# EasyEDA Pro project Project.epro, board PCB_AIO v4.5 Std AMP 2024-02-05
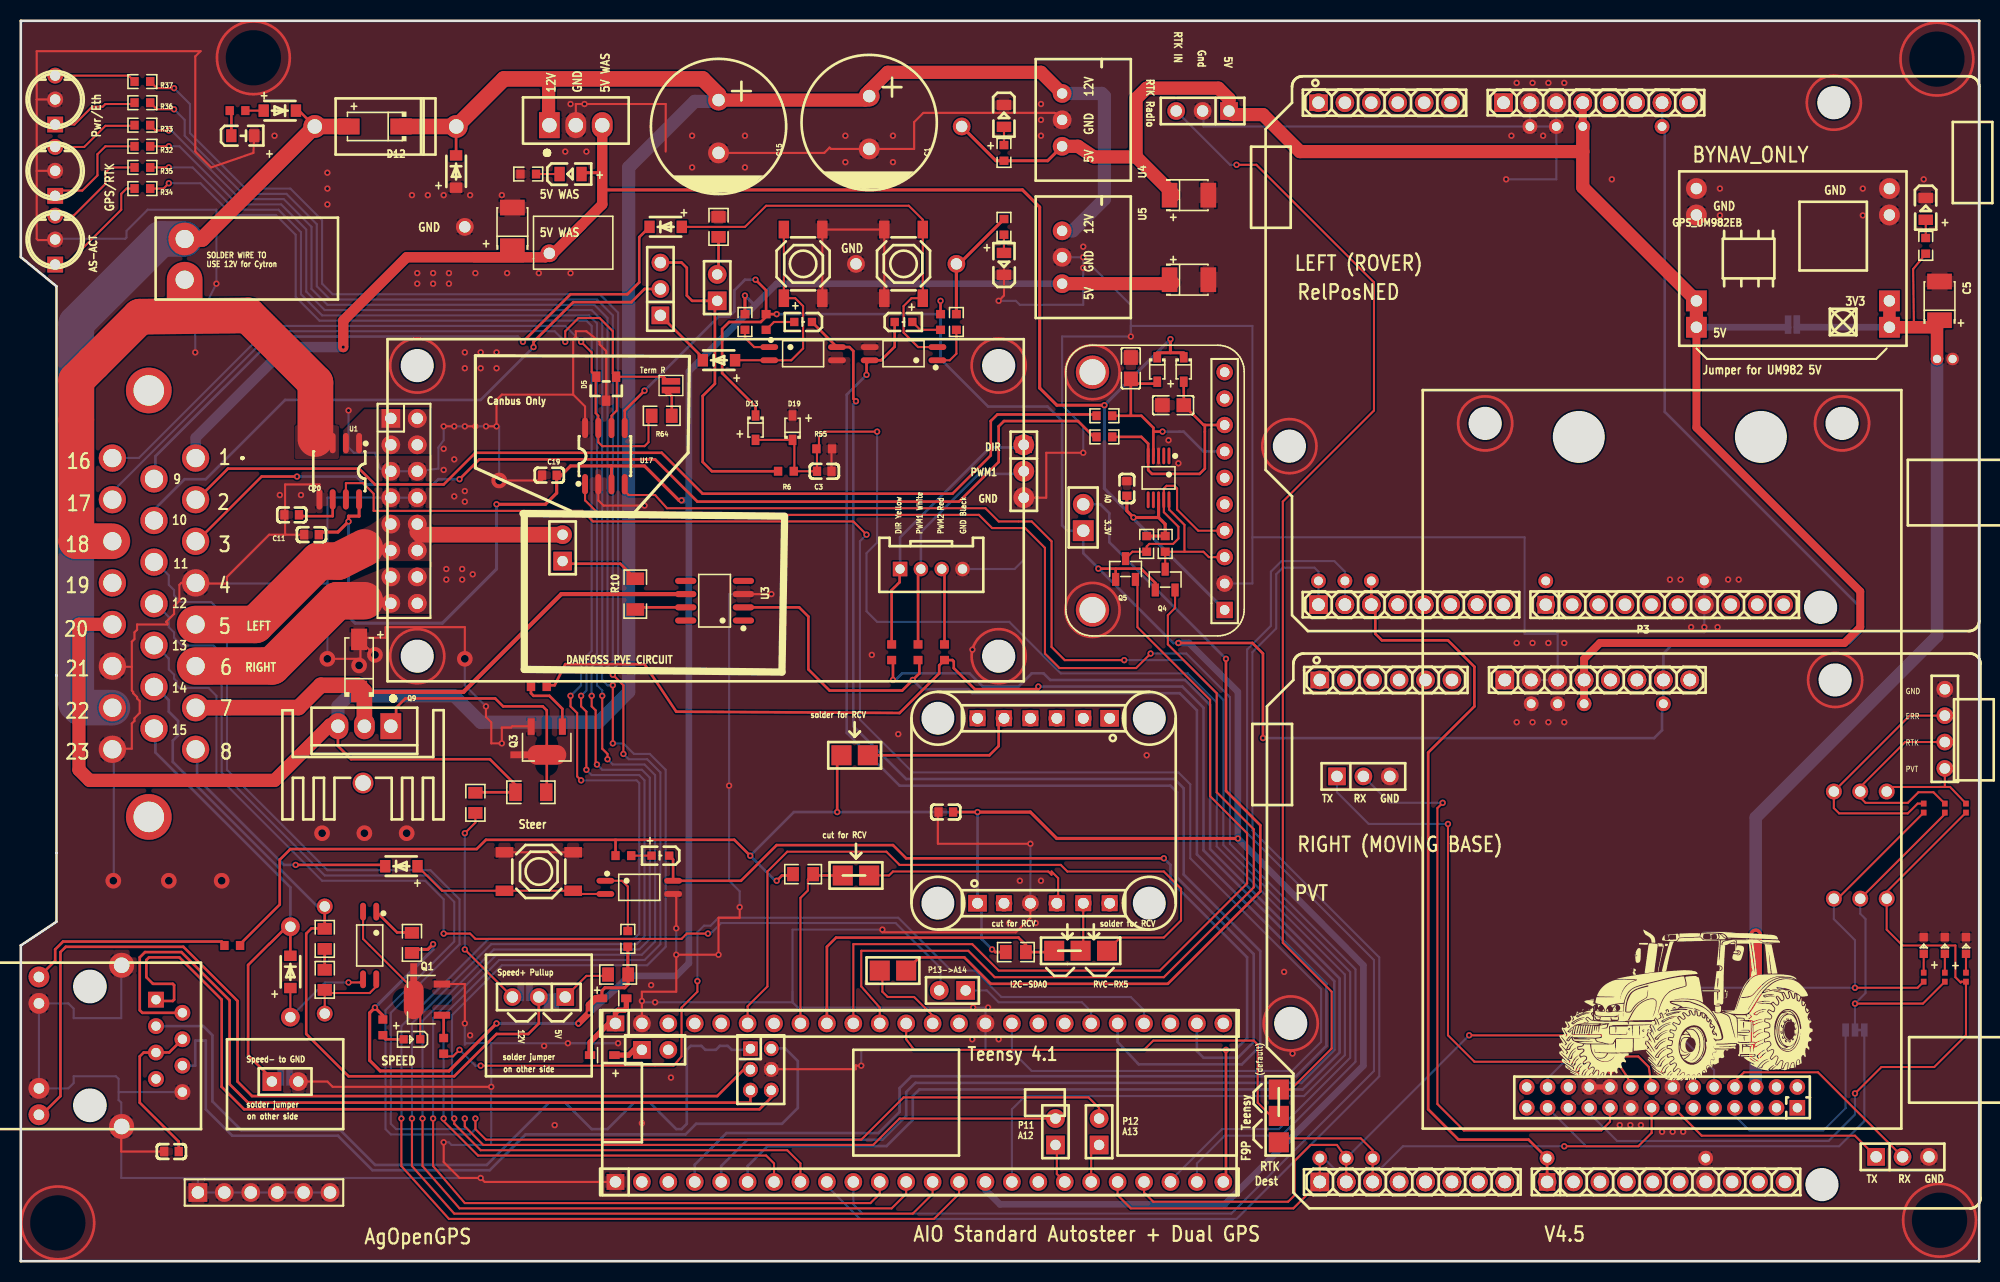
[diagram p0: board, top side]
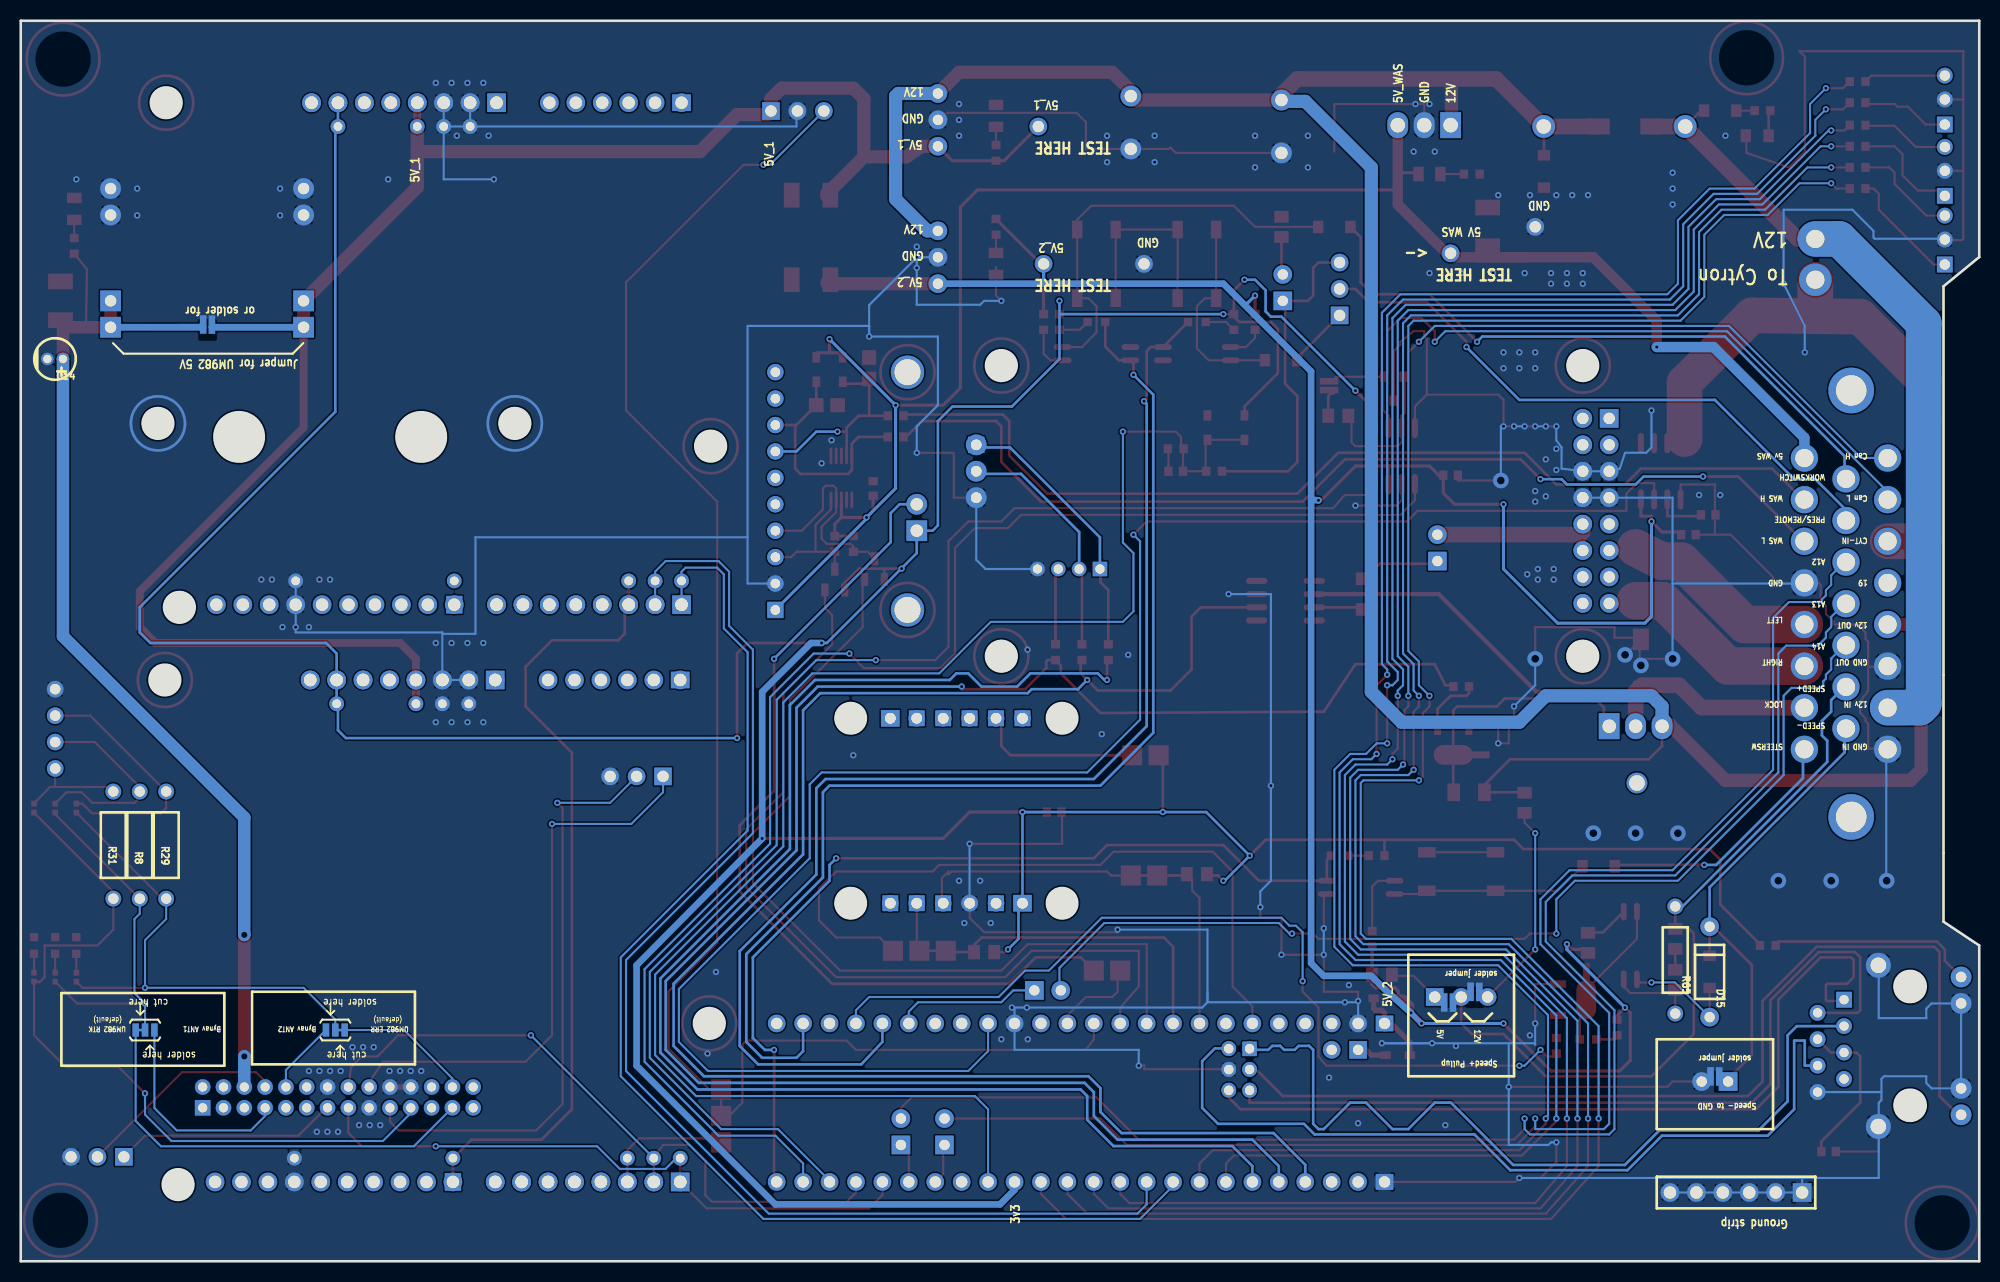
[diagram p1: board, bottom side, seen from below]

Outline 188.21 x 119.25 mm; copper layers: Top Layer, Bottom Layer. Coordinates in mm from the lower left corner of the outline.
Outline path: 0,119.25 188.21,119.25 188.21,0 0,0 0,30.35 3.43,32.64 3.43,93.73 0,96.54 0,119.25
Stack: Top Layer 0.035mm / Dielectric1 1.51mm FR4 er 4.5 / Bottom Layer 0.035mm

## Design rules (mm)
spacing Default (default): track to track 0.2, other pairs 0 to 0.2
spacing 1amp: track to track 0.2, other pairs 0 to 0.2
spacing 3v3: track to track 0.2, other pairs 0 to 0.2
spacing +5V: track to track 0.2, other pairs 0 to 0.2
spacing +15V: track to track 0.2, other pairs 0 to 0.2
spacing heavy: track to track 0.2, other pairs 0 to 0.2
track width Default (default): min 0.2, default 0.2, max 25.4
track width 1amp: min 0.254, default 0.254, max 25.4
track width 3v3: min 0.3, default 0.3, max 25.4
track width +5V: min 0.3, default 0.3, max 25.4
track width +15V: min 1.75, default 1.75, max 25.4
track width heavy: min 1.5, default 1.5, max 25.4
differential pair differentialPair (default): width min 0.127, default 0.254, max 2.54; gap min 0.152, default 0.152
via Default (default): diameter min 0.61, default 0.61, max 100.025; hole min 0.305, default 0.305, max 59.995
via 1amp: diameter min 0.61, default 0.61, max 100.025; hole min 0.305, default 0.305, max 59.995
via 3v3: diameter min 0.61, default 0.61, max 100.025; hole min 0.305, default 0.305, max 59.995
via +5V: diameter min 0.61, default 0.61, max 100.025; hole min 0.305, default 0.305, max 59.995
via +15V: diameter min 0.61, default 0.61, max 100.025; hole min 0.305, default 0.305, max 59.995
via heavy: diameter min 1.499, default 1.499, max 100.025; hole min 0.889, default 0.889, max 59.995
net CYTRON_AUX uses 1amp
net H10_2 uses 1amp
net STEERSW uses 1amp
net PWM2 uses 1amp
net PWM1 uses 1amp
net DIR uses 1amp
net STEERPIN uses 1amp
net WORKPIN uses 1amp
net PRES/REM uses 1amp
net 3.3V uses 1amp
net WAS_L uses 1amp
net WAS_H_2 uses 1amp
net WORKSW uses 1amp
net REMOTESW uses 1amp
net +12V_BOARD uses 1amp
net SPEED+ uses 1amp
net SPEED- uses 1amp
net H8_1 uses 1amp
net H8_2 uses 1amp
net REMOTEPIN uses 1amp
net R7_2 uses 1amp
net R48_2 uses 1amp
net WAS_L_2 uses 1amp
net FREEWHEELMOD uses 1amp
net PRESSURESENSE uses 1amp
net R10_1 uses 1amp
net R10_2 uses 1amp
net R66_2 uses 1amp
net R47_1 uses 1amp
net H18_5 uses 1amp
net H6_1 uses 1amp
net C20_1 uses 1amp
net R64_1 uses 1amp
net WAS_H uses 1amp
net 5V_WAS uses +5V
net 5V1 uses +5V
net 5V2 uses +5V
net +12V_IN uses heavy
net LOCK uses heavy
net RIGHT uses heavy
net LEFT uses heavy
net 12V_CYTRON uses heavy
pour e730 uses gge3228525
pour e1953 uses gge3228492
pour e1955 uses gge3228507

## Placement (name value [footprint] x y rotation side)
AS-ACT  DY-339URUYGW/SN  [LED-TH_3P-BD5.0-P2.54]  3.3 98.17 90 top
B/U_LED1  PVT/DIFF  [LED0603-RD COPY - NO SILK]  186.94 30.35 270 top
B/U_LED2  RTK/ANT1  [LED0603-RD COPY - NO SILK]  184.91 30.35 270 top
B/U_LED3  ERR/ANT2  [LED0603-RD COPY - NO SILK]  182.88 30.35 270 top
C1  1000uF  [CAP-TH_BD13.0-P5.00-D1.2-FD]  81.53 109.47 270 top
C2  100uF  [CASE-B_3528]  112.27 94.36 0 top
C3  100nF  [C0603]  77.22 75.95 180 top
C4  100uF  [CASE-B_3528]  47.24 99.44 90 top
C5  100uF  [CASE-B_3528]  184.4 92.33 90 top
C11  100nF_CAN  [C0603]  27.94 69.85 0 top
C14  22uF  [CAP-TH_BD4.0-P1.50-D0.8-FD]  184.91 86.74 0 bottom
C15  1000uF  [CAP-TH_BD13.0-P5.00-D1.2-FD]  67.06 109.09 270 top
C16  100nF  [C0603]  106.3 74.29 90 top
C17  100nF  [C0603]  88.9 43.18 0 top
C19  100nF  [C0603]  50.8 75.56 0 top
C20  1nF  [C0603]  26.03 71.75 180 top
C23  100uF  [CASE-B_3528]  112.27 102.49 0 top
C26  100nF  [C0603]  14.48 10.54 0 top
C30  10nF  [C0805]  106.68 85.85 270 top
C31  10nF  [C0805]  110.74 82.3 180 top
CN1  CYTRON CABLE  [CONN-TH_SEEED-110990030]  87.5 66.55 180 top
CN2  HEADER_ethernet-2X3P  [HDR-TH_6P-P2.00-V-F-R2-C3-S2.00]  71.12 18.42 270 top
D1  SM4007PL  [SOD-123F_L2.8-W1.8-LS3.7-RD]  36.58 37.97 0 top
D2  1N5819WS  [SOD-323_L1.8-W1.3-LS2.5-RD]  111.76 85.72 270 top
D3  SM4007PL  [SOD-123F_L2.8-W1.8-LS3.7-RD]  25.91 27.81 270 top
D4  SM4007PL  [SOD-123F_L2.8-W1.8-LS3.7-RD]  24.89 110.62 180 top
D5  PESD1CAN,215  [SOT-23_L2.9-W1.3-P1.90-LS2.4-BR]  56.26 83.88 90 top
D6  SS54_C22452  [SMA_L4.4-W2.8-LS5.4-R-RD]  34.04 109.09 180 top
D7  SM4007PL  [SOD-123F_L2.8-W1.8-LS3.7-RD]  41.83 104.76 270 top
D8  SS54_C22452  [SMA_L4.4-W2.8-LS5.4-R-RD]  32.51 57.28 90 top
D9  SM4007PL  [SOD-123F_L2.8-W1.8-LS3.7-RD]  67.09 86.62 0 top
D11  SM4007PL  [SOD-123F_L2.8-W1.8-LS3.7-RD]  61.98 99.44 0 top
D12  1N5401  [DO-201_BD5.3-L9.5-P13.50-D1.4-RD]  35.05 109.09 180 top
D13  1N5819WS  [SOD-323_L1.8-W1.3-LS2.5-RD]  70.61 80.14 270 top
D14  1N5819WS  [SOD-323_L1.8-W1.3-LS2.5-RD COPY - NO SILK]  57.02 25.27 180 top
D15  1N4004  [DO-41_BD2.4-L4.7-P8.70-D0.9-FD]  25.91 27.81 90 bottom
D19  1N5819WS  [SOD-323_L1.8-W1.3-LS2.5-RD]  74.17 80.14 90 top
D22  1N5819WS  [SOD-323_L1.8-W1.3-LS2.5-RD]  109.22 85.72 270 top
D41  1N5819WS  [SOD-323_L1.8-W1.3-LS2.5-RD COPY - NO SILK]  55.88 19.81 0 top
GPS/RTK  DY-339URUYGW/SN  [LED-TH_3P-BD5.0-P2.54]  3.3 104.77 90 top
GPS_UM982EB  UM982eb GPS  [UM982-NO-PADS - MIN]  170.73 14.75 0 top
H2  P11-A12  [HDR-TH_2P-P2.54-V-M-1]  99.44 12.45 90 top
H3  Ground  [HDR-TH_6P-P2.54-V-M-1]  23.37 6.6 0 top
H4  4-20ma  [HDR-TH_2P-P2.54-V-M-1]  66.93 93.6 90 top
H5  P12-A13  [HDR-TH_2P-P2.54-V-M-1]  103.63 12.45 90 top
H6  HEADER_F9P  [HDR-TH_10P-P2.54-V-F]  158.12 7.62 0 top
H7  HEADER_F9P  [HDR-TH_10P-P2.54-V-F]  157.99 63.12 0 top
H8  HEADER_3PIN  [HDR-TH_3P-P2.54-V-F]  96.39 75.95 270 top
H9  HEADER_ADS-MCP6002  [HDR-F-2.54_1X10]  115.7 74.04 90 top
H10  22850102ANG1SYA02  [HDR-TH_2P-P2.54-V-F]  102.11 71.5 90 top
H11  Speed-  [HDR-TH_2P-P2.54-V-M-1]  25.4 17.27 0 top
H12  PZ254V-11-03P_C2937625  [HDR-TH_3P-P2.54-V-M]  113.58 110.58 180 top
H13  HEADER_F9P  [HDR-TH_6P-P2.54-V-F]  131.19 55.88 0 top
H14  HEADER_F9P  [HDR-TH_6P-P2.54-V-F]  131.06 111.38 0 top
H15  P13-A14  [HDR-TH_2P-P2.54-V-M-1]  89.53 26.03 180 top
H16  Remote/Pressure  [HDR-TH_3P-P2.54-V-M]  61.47 93.47 90 top
H17  ByNav/UM982 uart3  [HDR-TH_3P-P2.54-V-M]  180.85 10.03 0 top
H18  HEADER_BNO  [HDR-TH_6P-P2.54-V-F]  98.3 52.2 180 top
H19  HEADER_BNO  [HDR-TH_6P-P2.54-V-F]  98.3 34.42 0 top
H20  2263-214SG0DYNT5 - wide  [HDR-TH_28P-P2.00-V-F-R2-C14-S2.00]  170.73 14.75 180 top
H21  VUSB  [HDR-TH_2P-P2.54-V-F#2]  60.96 20.32 0 top
H22  Danfoss Us  [HDR-TH_2P-P2.54-V-M-1]  52.07 68.58 90 top
H23  Speed+ Pullup  [HDR-TH_3P-P2.54-V-M]  49.78 25.4 180 top
H24_LEDS  Ext LEDs  [HDR-TH_4P-P2.54-V-F-2]  184.91 51.18 90 top
H25  ByNav/UM982 uart2  [HDR-TH_3P-P2.54-V-M]  129.03 46.61 0 top
J2  AMPSEAL 23 - 776087-1  [7760871-EXT]  16.8 77.21 270 top
J3  HEADER_Cytron 2x8  [HDR-TH_16P-P2.54-V-F-R2-C8-S2.54-1]  36.83 72.14 270 top
JP1  A0  [2_SOLDER_JUMPER_LG]  83.82 27.94 0 top
JP2  SPARKFUN-JUMPERS_JUMPER-SMT_2_NC_PASTE_NO-SILK  [SPARKFUN-JUMPERS_SMT-JUMPER_2_NC_PASTE_NO-SILK]  61.98 84.26 90 top
JP3  SLC  [2_SOLDER_JUMPER_LG]  80.26 37.08 0 top
JP4  RVC Mode  [2_SOLDER_JUMPER_LG]  80.14 48.64 180 top
JP6  SPARKFUN-JUMPERS_JUMPER-SMT_2_NC_PASTE_NO-SILK  [SPARKFUN-JUMPERS_SMT-JUMPER_2_NC_PASTE_NO-SILK#2]  25.31 17.76 180 bottom
JP7  SPARKFUN-JUMPERS_JUMPER-SMT_2_NC_PASTE_NO-SILK  [SPARKFUN-JUMPERS_SMT-JUMPER_2_NC_PASTE_NO-SILK#2]  51.08 24.88 0 bottom
JP8  SPARKFUN-JUMPERS_JUMPER-SMT_2_NC_PASTE_NO-SILK  [SPARKFUN-JUMPERS_SMT-JUMPER_2_NC_PASTE_NO-SILK#2]  48.37 25.88 180 bottom
JP9  UM982 5V  [SPARKFUN-JUMPERS_SMT-JUMPER_2_NC_PASTE_NO-SILK#2]  170.18 90.04 180 bottom
LED4  5V2  [LED0805-R-RD]  94.49 95.88 90 top
LED5  5V1  [LED0805-R-RD]  94.49 110.11 270 top
LED7  5V_WAS  [LED0805-R-RD]  52.83 104.52 0 top
LED8  3V3  [LED0805-R-RD]  183.08 101.17 270 top
LED12  SPEED_LED  [LED0603-RD]  37.59 21.34 180 top
LED18  INVERTED 12V!  [LED0805-RD]  21.34 108.2 0 top
LED_REMOTE  Remote  [LED0603-R-RD_WHITE]  75.18 90.3 180 top
LED_STEER  Steer  [LED0603-R-RD_WHITE]  61.47 38.99 180 top
LED_WORK  Work  [LED0603-R-RD_WHITE]  84.84 90.3 0 top
NOREF  -  [Pad_e4290]  90.42 109.09 0 top
NOREF#2  -  [Pad_e4155]  15.75 98.28 0 top
NOREF#3  -  [Pad_e4291]  89.92 95.88 0 top
NOREF#4  -  [Pad_e4289]  50.8 96.9 0 top
NOREF#5  -  [Pad_e4293]  80.26 95.88 270 top
NOREF#6  -  [Pad_e4156]  15.75 94.36 0 top
NOREF#7  -  [Pad_e4292]  42.67 99.44 270 top
OPTO_REMOTE  Remote  [SOP-4_L4.4-W2.8-P1.27-LS7.0-TL]  75.18 87.25 0 top
OPTO_SPEEDPULSE  Speed Pulse  [SOP-4_L4.4-W2.8-P1.27-LS7.0-TL]  33.53 30.35 270 top
OPTO_STEER  Steer  [SOP-4_L4.4-W2.8-P1.27-LS7.0-TL]  59.44 35.94 0 top
OPTO_WORK  Work  [SOP-4_L4.4-W2.8-P1.27-LS7.0-TL]  84.84 87.25 180 top
P2  Single/Dual-Right  [ARDUSIMPLE_F9P#2]  147.19 31.75 180 top
P3  F9P_RelPosNED  [ARDUSIMPLE_F9P]  147.07 87.25 180 top
P4  ADS1115  [ADS1115 BREAKOUT BOARD]  108.08 73.91 90 top
P5  Header_F9P  [HDR-TH_8P-P2.54-V-F-1]  133.73 7.62 0 top
P6  Header_F9P  [HDR-TH_8P-P2.54-V-F-1]  151.51 55.88 0 top
P7  Header_F9P  [HDR-TH_8P-P2.54-V-F-1]  151.38 111.38 0 top
P8  Header_F9P  [HDR-TH_8P-P2.54-V-F-1]  133.6 63.12 0 top
PWR/ETH  DY-339URUYGW/SN  [LED-TH_3P-BD5.0-P2.54]  3.3 111.63 90 top
Q1  D882_C9634  [SOT-89-3_L4.5-W2.5-P1.50-LS4.2-BR]  39.12 25.15 0 top
Q3  D882_C9634  [SOT-89-3_L4.5-W2.5-P1.50-LS4.2-BR]  50.55 50.04 90 top
Q4  2N7002  [SOT-23-3_L2.9-W1.3-P1.90-LS2.4-BR]  109.98 65.53 270 top
Q5  2N7002  [SOT-23-3_L2.9-W1.3-P1.90-LS2.4-BR]  106.17 66.55 270 top
Q9  IRF5305PBF  [TO-220-3_L10.0-W4.5-P2.54-T]  33.02 51.43 270 top
R1  1kΩ  [R0603 COPY - NO SILK]  71.63 90.3 270 top
R2  270Ω  [R0603]  58.34 30.99 270 top
R3  270Ω  [R0603]  69.6 90.3 90 top
R4  1kΩ  [R0603 COPY - NO SILK]  20.32 30.35 180 top
R5  1kΩ  [R0603 COPY - NO SILK]  83.69 58.55 90 top
R6  6.2kΩ  [R0603 COPY - NO SILK]  73.53 75.95 180 top
R7  200Ω  [R0805]  67.06 99.44 270 top
R8  1k  [RES-TH_BD2.4-L6.3-P10.30-D0.6]  176.78 40 270 bottom
R9  5.1kΩ  [R0603]  94.49 106.55 270 top
R10  1kΩ  [R1206]  59.06 64.13 90 top
R11  5.1kΩ  [R0603]  48.77 104.52 0 top
R12  2.2kΩ  [R0805]  75.18 37.21 0 top
R13  2.2kΩ  [R0805]  95.63 29.72 0 top
R14  1kΩ  [R0603 COPY - NO SILK]  88.39 90.3 270 top
R15  1kΩ  [R0603 COPY - NO SILK]  57.91 38.99 0 top
R16  270Ω  [R0603]  89.92 90.3 90 top
R17  5.1kΩ  [R0603]  94.49 99.44 90 top
R18  120Ω  [R0805]  29.21 27.05 270 top
R19  2.2kΩ  [R0805]  43.69 44.07 270 top
R20  3kΩ  [R0603]  183.08 97.62 90 top
R21  1kΩ  [R0603 COPY - NO SILK]  40.64 20.7 90 top
R22  5.1kΩ  [R0603]  108.2 68.96 270 top
R23  1kΩ  [R0603 COPY - NO SILK]  86.23 58.55 90 top
R24  1kΩ  [R0603 COPY - NO SILK]  49.78 55.24 180 top
R25  1kΩ  [R0603 COPY - NO SILK]  88.77 58.55 270 top
R26  1kΩ  [R0402 COPY - NO SILK]  184.91 27.3 90 top
R27  1kΩ  [R0402 COPY - NO SILK]  182.88 27.3 90 top
R28  1kΩ  [R0402 COPY - NO SILK]  182.88 43.56 90 top
R29  1k  [RES-TH_BD2.4-L6.3-P10.30-D0.6]  174.24 40 270 bottom
R30  1kΩ  [R0402 COPY - NO SILK]  186.94 43.56 90 top
R31  1k  [RES-TH_BD2.4-L6.3-P10.30-D0.6]  179.32 40 270 bottom
R32  330Ω  [R0603]  11.68 107.19 0 top
R33  330Ω  [R0603]  11.68 109.22 0 top
R34  330Ω  [R0603]  11.68 103.12 0 top
R35  330Ω  [R0603]  11.68 105.16 0 top
R36  330Ω  [R0603]  11.68 111.38 0 top
R37  330Ω  [R0603]  11.68 113.41 0 top
R38  1kΩ  [R0402 COPY - NO SILK]  184.91 43.56 90 top
R47  10kΩ  [R1206]  49.02 45.08 180 top
R48  200Ω  [R0805]  37.59 30.61 90 top
R53  1.5kΩ  [R0603]  104.14 81.28 180 top
R55  12kΩ  [R0603 COPY - NO SILK]  77.22 78.1 180 top
R56  1.5kΩ  [R0603]  104.14 79.25 180 top
R59  1kΩ  [R0402 COPY - NO SILK]  186.94 27.3 90 top
R62  2.2kΩ  [R0805]  57.4 27.56 180 top
R63  5.1kΩ  [R0603]  109.98 68.96 270 top
R64  120Ω  [R0805]  61.59 81.28 180 top
R65  330  [RES-TH_BD2.4-L6.3-P10.30-D0.6]  29.21 28.96 90 bottom
R66  200Ω  [R0805]  29.21 30.99 270 top
R104  2kΩ  [R0603 COPY - NO SILK]  34.8 22.48 270 top
R106  1kΩ  [R0603 COPY - NO SILK]  20.83 110.62 0 top
RJ1  HR913550A  [RJ45-TH_HR913550A]  8.64 20.7 90 top
SJ1  SDA/RX5  [3_SOLDER_JUMPER_LG]  103.12 29.84 0 top
SJ2  JUMPER-PAD-3-NO  [3_SOLDER_JUMPER_LG]  120.9 15.24 90 top
SJ_LED2  SJ_LED1  [PAD-JUMPER-3-2OF3_NC_BY_TRACE_YES]  176.28 22.22 0 bottom
SJ_LED3  SJ_LED1  [PAD-JUMPER-3-2OF3_NC_BY_TRACE_YES]  157.99 22.22 180 bottom
SW_REMOTE  Remote  [SW-SMD_4P-L5.1-W5.1-P3.70-LS6.5-TL-2]  75.18 95.88 90 top
SW_STEER  Steer  [SW-SMD_4P-L5.1-W5.1-P3.70-LS6.5-TL-2]  49.78 37.46 180 top
SW_WORK  Work  [SW-SMD_4P-L5.1-W5.1-P3.70-LS6.5-TL-2]  84.84 95.88 270 top
U1  ACS712ELCTR-05B-T  [SOIC-8_L5.0-W4.0-P1.27-LS6.0-BL]  30.61 75.95 180 top
U2  Cytron MD13S  [CYTRON MD13S]  66.04 72.14 270 top
U3  TC4427AEOA713  [SOIC-8_L4.9-W3.9-P1.27-LS6.0-BL]  66.67 63.5 90 top
U4  GNSS power  [PWRM-TH_K7805M-1000R3]  100.08 109.73 270 top
U5  Teensy/IMU Power  [PWRM-TH_K7805M-1000R3]  100.08 96.52 270 top
U6  MC7805CTG  [TO-220-3_L10.0-W4.5-P2.54-T#2]  53.34 109.22 90 top
U10  HEADER_TEENSY  [HDR-TH_24P-P2.54-V-F]  86.36 22.86 0 top
U11  HEADER_TEENSY  [HDR-TH_24P-P2.54-V-F]  86.36 7.62 0 top
U12  Teensy4.1 ETH only  [TEENSY4.1 ETH ONLY]  56.01 6.35 90 top
U13  HEAT_SINK  [SINK-TH_L15.0-W10.5-H21.0]  32.89 45.97 180 top
U15  Ardfruit BNO085  [ADAFRUIT-BNO085]  103.38 54.74 0 top
U16  -  [MP1584EN]  161.04 89.79 90 top
U17  MCP2562-E/SN  [SOIC-8_L5.0-W4.0-P1.27-LS6.0-BL]  56.13 77.41 0 top
U20  ADS1115IDGSR  [MSOP-10_L3.0-W3.0-P0.50-LS5.0-BL]  109.35 75.31 180 top

## Footprints (pads in the part's own frame, mm; a bottom-side part is the same pattern mirrored in y, then rotated)
2_SOLDER_JUMPER_LG
  rect 1.931x1.931 smd: 1(1.27,0) 2(-1.27,0)
3_SOLDER_JUMPER_LG
  rect 1.931x1.931 smd: 1(1.27,0) 2(-1.27,0) 3(-3.81,0)
7760871-EXT
  round 2.625 hole 1.755x1.75: 1(0,0) 2(4,0) 3(8,0) 4(12,0) 5(16,0) 6(20,0) 7(24,0) 8(28,0) 9(2,-4) 10(6,-4) 11(10,-4) 12(14,-4) 13(18,-4) 14(22,-4) 15(26,-4) 16(0,-8) 17(4,-8) 18(8,-8) 19(12,-8) 20(16,-8) 21(20,-8) 22(24,-8) 23(28,-8)
  round 4.395 hole 2.93x2.93: MH1(-6.5,-4.5) MH2(34.5,-4.5)
ADAFRUIT-BNO085
  rect 1.524x1.524 hole 1.016: 1(-11.43,-20.32) 2(-8.89,-20.32) 4(-3.81,-20.32) 5(-1.27,-20.32) 6(1.27,-20.32) 7(1.27,-2.54) 8(-1.27,-2.54) 9(-3.81,-2.54) 10(-6.35,-2.54) 11(-8.89,-2.54) 12(-11.43,-2.54)
  round 1.524 hole 1.016: 3(-6.35,-20.32)
ADS1115 BREAKOUT BOARD
  round 1.524 hole 0.914: 1(-11.303,-7.62) 2(-8.763,-7.62) 3(-6.223,-7.62) 4(-3.683,-7.62) 5(-1.143,-7.62) 6(1.397,-7.62) 7(3.937,-7.62) 8(6.477,-7.62) 9(9.017,-7.62) 10(11.557,-7.62)
  round 3.2 hole 2.499: P$1(-11.303,5.08) P$2(11.557,5.08)
ARDUSIMPLE_F9P
  round 1.8 hole 1.2: 1(0.508,24.13) 2(-2.032,24.13) 3(-4.572,24.13) 4(-7.112,24.13) 5(-9.652,24.13) 6(-12.192,24.13) 7(-14.732,24.13) 8(-17.272,24.13) 9(-19.812,24.13) 10(-22.352,24.13) 11(22.352,24.13) 12(19.811,24.13) 13(17.271,24.13) 14(14.732,24.13) 15(12.191,24.13) 16(9.652,24.13) 17(7.112,24.13) 18(4.572,24.13) 19(9.652,-24.13) 20(12.192,-24.13) 21(14.732,-24.13) 22(17.272,-24.13) 23(19.812,-24.13) 24(22.352,-24.13) 25(-13.208,-24.13) 26(-10.668,-24.13) 27(-8.128,-24.13) 28(-5.588,-24.13) 29(-3.048,-24.13) 30(-0.508,-24.13) 31(2.032,-24.13) 32(4.572,-24.13)
  round 1.423 hole 0.849: 1(0.508,21.845) 7(-14.732,21.844) 11(22.352,21.844) 12(19.811,21.844) 13(17.271,21.844) 26(-10.668,-21.844) 29(-3.048,-21.844) 30(-0.508,-21.844) 31(2.032,-21.844)
ARDUSIMPLE_F9P#2
  round 1.8 hole 1.2x1.205: 1(0.508,24.13) 2(-2.032,24.13) 3(-4.572,24.13) 4(-7.112,24.13) 5(-9.652,24.13) 6(-12.192,24.13) 7(-14.732,24.13) 8(-17.272,24.13) 9(-19.812,24.13) 10(-22.352,24.13) 11(22.352,24.13) 12(19.811,24.13) 13(17.271,24.13) 14(14.732,24.13) 15(12.191,24.13) 16(9.652,24.13) 17(7.112,24.13) 18(4.572,24.13) 19(9.652,-24.13) 20(12.192,-24.13) 21(14.732,-24.13) 22(17.272,-24.13) 23(19.812,-24.13) 24(22.352,-24.13) 25(-13.208,-24.13) 26(-10.668,-24.13) 27(-8.128,-24.13) 28(-5.588,-24.13) 29(-3.048,-24.13) 30(-0.508,-24.13) 31(2.032,-24.13) 32(4.572,-24.13)
  round 1.423 hole 0.849x0.854: 1(0.508,21.845) 7(-14.732,21.844) 11(22.352,21.844) 12(19.811,21.844) 13(17.271,21.844) 26(-10.668,-21.844) 29(-3.048,-21.844) 30(-0.508,-21.844) 31(2.032,-21.844)
C0603
  rect 0.8x0.9 smd: 1(-0.7,0) 2(0.7,0)
C0805
  rect 1.41x1.35 smd: 1(-1.03,0) 2(1.03,0)
CAP-TH_BD4.0-P1.50-D0.8-FD
  round 1.2 hole 0.8: 1(-0.75,0) 2(0.75,0)
CAP-TH_BD13.0-P5.00-D1.2-FD
  round 2 hole 1.2: 1(-2.54,0) 2(2.54,0)
CASE-B_3528
  rect 1.506x2.376 smd: 1(-1.861,0) 2(1.861,0)
CONN-TH_SEEED-110990030
  rect 1.4x1.4 hole 0.9: 1(3,0)
  round 1.4 hole 0.9: 2(1,0) 3(-1,0) 4(-3,0)
CYTRON MD13S
  round 2 hole 1: 1(-6.35,30.353) 2(-3.81,30.353) 3(-1.27,30.353)
  round 1.75 hole 1: 4(-8.89,-27.94) 4(-6.35,-27.94) 5(-3.81,-27.94) 5(-1.27,-27.94) 6(1.27,-27.94) 6(3.81,-27.94) 7(6.35,-27.94) 7(8.89,-27.94)
DO-41_BD2.4-L4.7-P8.70-D0.9-FD
  round 1.8 hole 1: 1(-4.35,0) 2(4.35,0)
DO-201_BD5.3-L9.5-P13.50-D1.4-RD
  round 2.2 hole 1.4: 1(-6.8,0) 2(6.8,0)
HDR-F-2.54_1X10
  rect 1.575x1.575 hole 0.889: 1(-11.43,0)
  round 1.575 hole 0.889: 2(-8.89,0) 3(-6.35,0) 4(-3.81,0) 5(-1.27,0) 6(1.27,0) 7(3.81,0) 8(6.35,0) 9(8.89,0) 10(11.43,0)
HDR-TH_2P-P2.54-V-F
  rect 2x2 hole 1.2: 1(-1.27,0)
  round 2 hole 1.2: 2(1.27,0)
HDR-TH_2P-P2.54-V-F#2
  rect 1.7x1.7 hole 1: 1(-1.27,0)
  round 1.7 hole 1: 2(1.27,0)
HDR-TH_2P-P2.54-V-M-1
  rect 1.8x1.8 hole 1: 1(-1.27,0)
  round 1.8 hole 1: 2(1.27,0)
HDR-TH_3P-P2.54-V-F
  rect 1.575x1.575 hole 1.02: 1(-2.54,0)
  round 1.575 hole 1.02: 2(0,0) 3(2.54,0)
HDR-TH_3P-P2.54-V-M
  rect 1.7x1.7 hole 1.1: 1(-2.54,0)
  round 1.7 hole 1.1: 2(0,0) 3(2.54,0)
HDR-TH_4P-P2.54-V-F-2
  round 1.6 hole 1.02: 1(-3.81,0) 2(-1.27,0) 3(1.27,0) 4(3.81,0)
HDR-TH_6P-P2.00-V-F-R2-C3-S2.00
  rect 1.4x1.4 hole 0.9: 1(-2,-1)
  round 1.4 hole 0.9: 2(-2,1) 3(0,-1) 4(0,1) 5(2,-1) 6(2,1)
HDR-TH_6P-P2.54-V-F
  rect 1.8x1.6 hole 1.02: 1(-6.35,0)
  round 1.6 hole 1.02: 2(-3.81,0) 3(-1.27,0) 4(1.27,0) 5(3.81,0) 6(6.35,0)
HDR-TH_6P-P2.54-V-M-1
  rect 1.8x1.8 hole 1.2: 1(-6.35,0)
  round 1.8 hole 1.2: 2(-3.81,0) 3(-1.27,0) 4(1.27,0) 5(3.81,0) 6(6.35,0)
HDR-TH_8P-P2.54-V-F-1
  rect 1.8x1.8 hole 1.2: 1(-8.89,0)
  round 1.8 hole 1.2: 2(-6.35,0) 3(-3.81,0) 4(-1.27,0) 5(1.27,0) 6(3.81,0) 7(6.35,0) 8(8.89,0)
HDR-TH_10P-P2.54-V-F
  rect 1.575x1.7 hole 1.1: 1(-11.43,0)
  round 1.7 hole 1.1: 2(-8.89,0) 3(-6.35,0) 4(-3.81,0) 5(-1.27,0) 6(1.27,0) 7(3.81,0) 8(6.35,0) 9(8.89,0) 10(11.43,0)
HDR-TH_16P-P2.54-V-F-R2-C8-S2.54-1
  rect 1.8x1.8 hole 1.1: 1(-8.89,-1.27)
  round 1.8 hole 1.1: 2(-8.89,1.27) 3(-6.35,-1.27) 4(-6.35,1.27) 5(-3.81,-1.27) 6(-3.81,1.27) 7(-1.27,-1.27) 8(-1.27,1.27) 9(1.27,-1.27) 10(1.27,1.27) 11(3.81,-1.27) 12(3.81,1.27) 13(6.35,-1.27) 14(6.35,1.27) 15(8.89,-1.27) 16(8.89,1.27)
HDR-TH_24P-P2.54-V-F
  rect 1.7x1.524 hole 1.1: 1(-29.21,0)
  round 1.7 hole 1.1: 2(-26.67,0) 3(-24.13,0) 4(-21.59,0) 5(-19.05,0) 6(-16.51,0) 7(-13.97,0) 8(-11.43,0) 9(-8.89,0) 10(-6.35,0) 11(-3.81,0) 12(-1.27,0) 13(1.27,0) 14(3.81,0) 15(6.35,0) 16(8.89,0) 17(11.43,0) 18(13.97,0) 19(16.51,0) 20(19.05,0) 21(21.59,0) 22(24.13,0) 23(26.67,0) 24(29.21,0)
HDR-TH_28P-P2.00-V-F-R2-C14-S2.00
  rect 1.5x1.5 hole 0.889: 1(0,0)
  round 1.5 hole 0.889: 2(0,-2) 3(2,0) 4(2,-2) 5(4,0) 6(4,-2) 7(6,0) 8(6,-2) 9(8,0) 10(8,-2) 11(10,0) 12(10,-2) 13(12,0) 14(12,-2) 15(14,0) 16(14,-2) 17(16,0) 18(16,-2) 19(18,0) 20(18,-2) 21(20,0) 22(20,-2) 23(22,0) 24(22,-2) 25(24,0) 26(24,-2) 27(26,0) 28(26,-2)
LED0603-R-RD_WHITE
  rect 0.8x0.8 smd: 1(0.851,0) 2(-0.851,0)
LED0603-RD
  rect 0.8x0.8 smd: 1(-0.799,-0.004) 2(0.799,0.004)
LED0603-RD COPY - NO SILK
  rect 0.8x0.8 smd: 1(-0.799,-0.004) 2(0.799,0.004)
LED0805-R-RD
  rect 1x1.399 smd: 1(1.05,0) 2(-1.05,0)
LED0805-RD
  rect 1x1.25 smd: 1(-1.1,0) 2(1.1,0)
LED-TH_3P-BD5.0-P2.54
  rect 1.524x1.524 hole 1: 1(-2.349,0)
  round 1.524 hole 1: 2(0.059,0) 3(2.349,0)
MP1584EN
  rect 2x2 hole 1.1: 1(0,0) 1(2.54,0) 3(0,-18.55) 3(2.54,-18.55)
  round 2 hole 1.1: 2(10.795,0) 2(13.335,0) 4(10.795,-18.55) 4(13.335,-18.55)
MSOP-10_L3.0-W3.0-P0.50-LS5.0-BL
  oval 0.28x1.62 smd: 1(-1,-2.11) 2(-0.5,-2.11) 3(0,-2.11) 4(0.5,-2.11) 5(1,-2.11) 6(1,2.11) 7(0.5,2.11) 8(0,2.11) 9(-0.5,2.11) 10(-1,2.11)
PAD-JUMPER-3-2OF3_NC_BY_TRACE_YES
  custom 0.635x1.27 smd: 1(-0.9,0) 2(0,0) 3(0.9,0)
Pad_e4155
  round 3.13 hole 1.752: 1(0,0)
Pad_e4156
  round 3.13 hole 1.752: 2(0,0)
Pad_e4289
  round 1.7 hole 1.1: 3(0,0)
Pad_e4290
  round 1.7 hole 1.1: 4(0,0)
Pad_e4291
  round 1.7 hole 1.1: 4(0,0)
Pad_e4292
  round 1.7 hole 1.1: 2(0,0)
Pad_e4293
  round 1.7 hole 1.1: 2(0,0)
PWRM-TH_K7805M-1000R3
  round 1.8 hole 1: 1(-2.54,0) 2(0,0) 3(2.54,0)
R0402 COPY - NO SILK
  rect 0.566x0.54 smd: 1(-0.433,0) 2(0.433,0)
R0603
  rect 0.806x0.864 smd: 1(-0.753,0) 2(0.753,0)
R0603 COPY - NO SILK
  rect 0.806x0.864 smd: 1(-0.753,0) 2(0.753,0)
R0805
  rect 1.133x1.377 smd: 1(-0.966,0) 2(0.966,0)
R1206
  rect 1.208x1.701 smd: 1(-1.479,0) 2(1.479,0)
RES-TH_BD2.4-L6.3-P10.30-D0.6
  round 1.524 hole 1: 1(-5.15,0) 2(5.15,0)
RJ45-TH_HR913550A
  rect 1.524x1.524 hole 0.9: 1(4.44,-4.355)
  round 1.524 hole 0.9: 2(3.18,-6.895) 3(1.9,-4.355) 4(0.64,-6.895) 5(-0.64,-4.355) 6(-1.9,-6.895) 7(-3.18,-4.355) 8(-4.44,-6.895)
  round 2 hole 1.02: 9(6.625,6.895) 10(4.085,6.895) 11(-4.085,6.895) 12(-6.625,6.895)
  round 2.4 hole 1.5: 13(7.75,-1.055) 14(-7.75,-1.055)
SINK-TH_L15.0-W10.5-H21.0
  round 2 hole 1.5: 1(0,0)
SMA_L4.4-W2.8-LS5.4-R-RD
  rect 2.062x1.539 smd: 1(2.503,0) 2(-2.503,0)
SOD-123F_L2.8-W1.8-LS3.7-RD
  rect 1x1.2 smd: 1(-1.55,0) 2(1.55,0)
SOD-323_L1.8-W1.3-LS2.5-RD
  rect 1x0.75 smd: 1(-1.173,0) 2(1.173,0)
SOD-323_L1.8-W1.3-LS2.5-RD COPY - NO SILK
  rect 1x0.75 smd: 1(-1.173,0) 2(1.173,0)
SOIC-8_L4.9-W3.9-P1.27-LS6.0-BL
  oval 0.588x2.045 smd: 1(-1.905,-2.772) 2(-0.635,-2.772) 3(0.635,-2.772) 4(1.905,-2.772) 5(1.905,2.772) 6(0.635,2.772) 7(-0.635,2.772) 8(-1.905,2.772)
SOIC-8_L5.0-W4.0-P1.27-LS6.0-BL
  oval 0.569x1.95 smd: 1(-1.905,-2.705) 2(-0.635,-2.705) 3(0.635,-2.705) 4(1.905,-2.705) 5(1.905,2.705) 6(0.635,2.705) 7(-0.635,2.705) 8(-1.905,2.705)
SOP-4_L4.4-W2.8-P1.27-LS7.0-TL
  oval 1.71x0.56 smd: 1(-3.255,0.635) 2(-3.255,-0.635) 3(3.255,-0.635) 4(3.255,0.635)
SOT-23-3_L2.9-W1.3-P1.90-LS2.4-BR
  rect 1.25x0.7 smd: 1(1,-0.95) 2(1,0.95) 3(-1,0)
SOT-23_L2.9-W1.3-P1.90-LS2.4-BR
  rect 1x0.8 smd: 1(1.15,-0.95) 2(1.15,0.95) 3(-1.15,0)
SOT-89-3_L4.5-W2.5-P1.50-LS4.2-BR
  rect 1.575x0.672 smd: 1(1.357,-1.5) 3(1.357,1.5)
  custom 1.9x5.377 smd: 2(-1.356,-0.001)
SPARKFUN-JUMPERS_SMT-JUMPER_2_NC_PASTE_NO-SILK
  custom 0.635x1.778 smd: 1(-0.508,0.254) 2(0.33,-0.254)
SPARKFUN-JUMPERS_SMT-JUMPER_2_NC_PASTE_NO-SILK#2
  custom 0.635x1.778 smd: 1(-0.508,-0.246) 2(0.331,-0.254)
SW-SMD_4P-L5.1-W5.1-P3.70-LS6.5-TL-2
  rect 1.7x1 smd: 1(-3.3,1.85) 2(3.3,1.85) 3(-3.3,-1.85) 4(3.3,-1.85)
TEENSY4.1 ETH ONLY
  round 1.524 hole 0.95: 1(1.27,-1.143) 2(1.27,-3.683) 3(1.27,-6.223) 4(1.27,-8.763) 5(1.27,-11.303) 6(1.27,-13.843) 7(1.27,-16.383) 8(1.27,-18.923) 9(1.27,-21.463) 10(1.27,-24.003) 11(1.27,-26.543) 12(1.27,-29.083) 13(1.27,-31.623) 14(1.27,-34.163) 15(1.27,-36.703) 16(1.27,-39.243) 17(1.27,-41.783) 18(1.27,-44.323) 19(1.27,-46.863) 20(1.27,-49.403) 21(1.27,-51.943) 22(1.27,-54.483) 23(1.27,-57.023) 24(1.27,-59.563) 25(16.51,-59.563) 26(16.51,-57.023) 27(16.51,-54.483) 28(16.51,-51.943) 29(16.51,-49.403) 30(16.51,-46.863) 31(16.51,-44.323) 32(16.51,-41.783) 33(16.51,-39.243) 34(16.51,-36.703) 35(16.51,-34.163) 36(16.51,-31.623) 37(16.51,-29.083) 38(16.51,-26.543) 39(16.51,-24.003) 40(16.51,-21.463) 41(16.51,-18.923) 42(16.51,-16.383) 43(16.51,-13.843) 44(16.51,-11.303) 45(16.51,-8.763) 46(16.51,-6.223) 47(16.51,-3.683) 48(16.51,-1.143)
  round 1.4 hole 0.85: 60(14.11,-14.113) 61(12.11,-14.113) 62(10.11,-14.113) 63(10.11,-16.113) 64(12.11,-16.113) 65(14.11,-16.113)
TO-220-3_L10.0-W4.5-P2.54-T
  rect 2.5x2 hole 1.3: 1(0,2.54)
  oval 2.5x2 hole 1.3: 2(0,0) 3(0,-2.54)
TO-220-3_L10.0-W4.5-P2.54-T#2
  rect 2.5x2 hole 1.4: 1(0,2.54)
  oval 2.5x2 hole 1.4: 2(0,0) 3(0,-2.54)

## Nets
3.3V: C17.2 D13.1 H10.1 H19.1 JP4.1 P2.26 P3.26 P6.7 P7.7 Q4.1 Q5.1 R1.1 R4.1 R12.1 R13.1 R14.1 R15.1 U11.15 U12.15 U15.1 U17.5
5V1: C23.1 H12.1 JP9.2 NOREF.4 P2.29 P3.29 P6.4 P7.4 R9.2 U4.3 U16.1
5V2: C2.1 C11.2 C19.2 D14.2 NOREF#3.4 R2.2 R3.2 R16.2 R17.2 R48.1 R62.1 R104.1 U1.8 U5.3 U17.3
5V_WAS: C4.1 C16.1 D2.1 D22.1 H9.1 J2.1 LED7.1 NOREF#4.3 P4.1 R22.1 R63.1 U6.3 U20.8
12V_CYTRON: J3.1 J3.2 J3.3 J3.4 U1.1 U1.2 U2.4
+12V_BOARD: C1.1 C15.1 D6.2 D7.1 D12.1 J2.20 Q9.3 R19.1 R47.2 U4.1 U5.1 U6.1
+12V_IN: D4.1 D6.1 D12.2 J2.22 NOREF#2.1
GND: AS-ACT.2 B/U_LED1.1 B/U_LED2.1 B/U_LED3.1 C1.2 C2.2 C3.1 C4.2 C5.2 C11.1 C14.2 C15.2 C16.2 C17.1 C19.1 C20.2 C23.2 C26.1 C30.1 C31.2 CN1.4 CN2.4 D5.3 D7.2 D8.1 D19.2 GPS/RTK.2 H3.1 H3.2 H3.3 H3.4 H3.5 H3.6 H6.7 H7.7 H8.3 H9.2 H11.2 H12.2 H17.3 H19.3 H20.14 H20.17 H20.20 H20.22 H24_LEDS.4 H25.3 J2.4 J2.21 J2.23 J3.5 J3.6 J3.7 J3.8 JP6.1 LED4.2 LED5.2 LED8.2 LED18.2 NOREF#5.2 NOREF#7.2 OPTO_REMOTE.3 OPTO_STEER.3 OPTO_WORK.3 P2.7 P2.30 P2.31 P3.7 P3.30 P3.31 P4.2 P6.2 P6.3 P7.2 P7.3 PWR/ETH.2 Q1.3 Q3.3 R7.1 R11.1 R55.1 RJ1.8 RJ1.10 RJ1.11 RJ1.13 RJ1.14 SW_REMOTE.3 SW_REMOTE.4 SW_STEER.3 SW_STEER.4 SW_WORK.3 SW_WORK.4 U1.5 U2.3 U2.5 U3.3 U4.2 U5.2 U6.2 U10.2 U10.15 U11.1 U12.1 U12.34 U12.47 U12.64 U15.3 U16.2 U16.4 U17.2 U17.8 U20.3
A0: JP1.2 U10.13 U12.36
A7-RX5: SJ1.1 U10.6 U12.43
A10: C3.2 D13.2 D19.1 R6.1 R55.2 U11.16 U12.16
A12: H2.1 U11.18 U12.18
A12B: H2.2 J2.11
A13: H5.1 U11.19 U12.19
A13B: H5.2 J2.12
A14: H15.1 U10.19 U12.30
A14B: H15.2 J2.13
A15: U10.18 U12.31
A16: U10.17 U12.32
A17: U1.7 U10.16 U12.33
AS-ACT_1: AS-ACT.1 R34.1
AS-ACT_3: AS-ACT.3 R35.1
AS_ACT: R34.2 U11.14 U12.14
AS_STB: R35.2 U11.13 U12.13
B/U_LED1_2: B/U_LED1.2 R59.2
BNO-SDA: H19.5 R13.2 SJ1.2 SJ1.3 U10.9 U12.40 U15.5
BY-ANT1: H20.7 SJ_LED2.1
BY-ANT2: H20.10 SJ_LED3.1
BYNAV/UM982: C5.1 C14.1 H20.6 JP9.1 R20.1 U16.3
C20_1: C20.1 U1.6
CANH1: D5.2 J2.16 R64.2 U17.7
CANL1: D5.1 J2.17 JP2.2 U17.6
CANRX1: U11.22 U12.22 U17.4
CANTX1: U11.23 U12.23 U17.1
CYTRON_AUX: J2.18 NOREF#6.2 U1.3 U1.4
D1_2: D1.2 OPTO_STEER.2 SW_STEER.1 SW_STEER.2
D4_2: D4.2 R106.2
D9_2: D9.2 OPTO_REMOTE.2 SW_REMOTE.1 SW_REMOTE.2
D11_2: D11.2 OPTO_WORK.2 SW_WORK.1 SW_WORK.2
D15_1: D3.2 D15.1 OPTO_SPEEDPULSE.3
DIR: R5.1 U11.6 U12.6
ERR_STAT: H20.26 SJ_LED3.3
ETHERNET: R36.2 U11.8 U12.8
FREEWHEELMOD: CN1.3 R25.1
GPS/RTK_1: GPS/RTK.1 R32.1
GPS/RTK_3: GPS/RTK.3 R33.1
GPSFIX: R33.2 U11.11 U12.11
H6_1: H6.1 P2.1 P3.13 P8.3
H8_1: CN1.1 H8.1 R5.2 U2.1
H8_2: CN1.2 H8.2 R23.2 U2.2
H10_2: H10.2 JP1.1
H18_5: H18.5 JP4.2 U15.11
H24_LEDS_1: H24_LEDS.1 R30.2 R31.1
H24_LEDS_2: H24_LEDS.2 R8.1 R38.2
H24_LEDS_3: H24_LEDS.3 R28.2 R29.1
L2: R8.2 R26.1 R38.1 SJ_LED2.2
L3: R27.1 R28.1 R29.2 SJ_LED3.2
LED12_1: LED12.1 OPTO_SPEEDPULSE.2 Q1.2
LED12_2: LED12.2 R104.2
LED18_1: LED18.1 R106.1
LED_REMOTE_1: LED_REMOTE.1 R1.2
LED_STEER_1: LED_STEER.1 R15.2
LED_WORK_1: LED_WORK.1 R14.2
LEFT: H22.2 J2.5 J3.9 J3.10 J3.11 J3.12 U2.6
LOCK: D8.2 J2.7 Q9.2 U3.6
POWERON: R37.2 U11.7 U12.7
PRES/REM: H16.2 J2.10
PRESSURESENSE: H4.1 H16.3 R6.2
PVT_STAT/DIFF: H20.21 R30.1 R31.2 R59.1
PWM1: R23.1 U3.2 U11.4 U12.4
PWM2: R24.1 R25.2 U11.5 U12.5
PWR/ETH_1: PWR/ETH.1 R36.1
PWR/ETH_3: PWR/ETH.3 R37.1
Q1_1: Q1.1 R21.2
Q3_1: Q3.1 R24.2
R2_1: OPTO_STEER.1 R2.1
R3_1: OPTO_REMOTE.1 R3.1
R7_2: H4.2 R7.2
R9_1: LED5.1 R9.1
R10_1: R10.1 U3.7
R10_2: H22.1 R10.2
R11_2: LED7.2 R11.2
R16_1: OPTO_WORK.1 R16.1
R17_1: LED4.1 R17.1
R18_2: OPTO_SPEEDPULSE.4 R18.2 R65.1
R20_2: LED8.1 R20.2
R26_2: B/U_LED2.2 R26.2
R27_2: B/U_LED3.2 R27.2
R47_1: Q3.2 Q9.1 R47.1
R48_2: OPTO_SPEEDPULSE.1 R48.2
R62_2: H23.1 JP7.2 R62.2
R64_1: JP2.1 R64.1
R66_2: R18.1 R66.2
R+: CN2.1 RJ1.3 U12.60
R-: CN2.2 RJ1.6 U12.65
REMOTEPIN: D9.1 H16.1
REMOTESW: LED_REMOTE.2 OPTO_REMOTE.4 U10.20 U12.29
RIGHT: J2.6 J3.13 J3.14 J3.15 J3.16 U2.7
RJ1_5: C26.2 RJ1.4 RJ1.5
RJ1_9: R4.2 RJ1.9
RJ1_12: CN2.3 RJ1.12 U12.61
RTK_STAT: H20.25 SJ_LED2.3
RTKFIX: R32.2 U11.12 U12.12
RX1: H20.15 P2.11 P5.1 U11.20 U12.20
RX2: P3.11 P8.1 U11.9 U12.9
SCL0: H19.4 JP3.1 JP3.2 R12.2 U10.8 U12.41 U15.4
SCL_HV: H9.3 P4.3 Q4.3 R63.2 U20.10
SCL_LV: Q4.2 U10.11 U12.38
SDA_HV: H9.4 P4.4 Q5.3 R22.2 U20.9
SDA_LV: Q5.2 U10.10 U12.39
SIG: H12.3 SJ2.1 SJ2.2 U10.12 U12.37
SJ3_3: H23.3 JP8.2 R19.2
SPEED+: H23.2 J2.14 JP7.1 JP8.1 R65.2 R66.1
SPEED-: D3.1 D15.2 H11.1 J2.15 JP6.2
SPEEDPULSE: R21.1 U10.21 U12.28
STEERPIN: D1.1 J2.8
STEERSW: LED_STEER.2 OPTO_STEER.4 U11.24 U12.24
T+: CN2.6 RJ1.1 U12.63
T-: CN2.5 RJ1.2 U12.62
T_VUSB: D41.2 H21.1
TX1: H20.16 P2.12 P5.2 U11.21 U12.21
TX2: P3.12 P8.2 U11.10 U12.10
TX2_F9P: P2.13 P5.3 SJ2.3
U9_2: U10.22 U12.27
U9_4: U10.24 U12.25
U12_2: U11.2 U12.2
U12_3: U11.3 U12.3
U12_17: U11.17 U12.17
U12_35: U10.14 U12.35
U12_42: U10.7 U12.42
U12_44: U10.5 U12.44
U12_45: U10.4 U12.45
U12_46: U10.3 U12.46
U12_48: D14.1 D41.1 U10.1 U12.48
U-RX2: H20.19 H25.2
U-RX3: H17.2 H20.8
U-TX2: H20.18 H25.1
U-TX3: H17.1 H20.13
WAS_H: J2.2 R53.2
WAS_H_2: C30.2 D22.2 H9.7 P4.7 R53.1 U20.4
WAS_L: J2.3 R56.2
WAS_L_2: C31.1 D2.2 H9.8 P4.8 R56.1 U20.5
WORKPIN: D11.1 J2.9
WORKSW: LED_WORK.2 OPTO_WORK.4 U10.23 U12.26

Pads without a net: H6 2 3 4 5 6 8 9 10; H7 1 2 3 4 5 6 8 9 10; H9 5 6 9 10; H13 1 2 3 4 5 6; H14 1 2 3 4 5 6; H18 1 2 3 4 6; H19 2 6; H20 1 2 3 4 5 9 11 12 23 24 27 28; H21 2; J2 19 MH1 MH2; P2 2 3 4 5 6 8 9 10 14 15 16 17 18 19 20 21 22 23 24 25 27 28 32; P3 1 2 3 4 5 6 8 9 10 14 15 16 17 18 19 20 21 22 23 24 25 27 28 32; P4 5 6 9 10 P$1 P$2; P5 4 5 6 7 8; P6 1 5 6 8; P7 1 5 6 8; P8 4 5 6 7 8; RJ1 7; U3 1 4 5 8; U13 1; U15 2 6 7 8 9 10 12; U20 1 2 6 7

## Via types
v1: diameter 0.61, hole 0.305, Top Layer to Bottom Layer, 243 vias
v2: diameter 1.5, hole 0.75, Top Layer to Bottom Layer, 11 vias
v3: diameter 1.2, hole 0.6, Top Layer to Bottom Layer, 2 vias

## Routing (per net, layer and track width the routed paths; a pad name or vN(x,y) marks a point on that pad's centre or on a via; arc(x,y) is an arc through that point)
3.3V: length 480.9
  Top Layer w0.254: Q5.1 105.22,66.58 ; v1(72.64,36.58) 73.15,37.08 74.09,37.08 R12.1 ; R13.1 93.65,29.72 93.4,29.97 v1(93.34,29.97) ; R15.1 57.16,40.51 ; v1(78.46,43.18) 78.46,48.23 JP4.1 ; 109.03,64.53 109.03,65.21 107.66,66.58 v1(103.56,66.58) ; v1(70.1,38.98) 68.57,40.51 44.7,40.51 43.81,39.62 25.91,39.62 24.88,38.6 24.88,34.29 21.07,30.48 ; v1(119.38,50.29) 119.38,58.42 118.36,59.44 v1(111.25,59.44) ; v1(59.94,83.69) 58.04,81.79 U17.5 ; R1.1 71.63,90.8 71.12,90.3 68.07,90.3 67.4,89.63 67.4,85.38 70.61,82.17 70.61,81.31 ; R1.1 v1(72.64,91.05) ; R1.1 71.63,93.34 v1(70.61,94.36) ; v1(91.95,43.18) C17.2 ; v1(88.39,92.33) R14.1
  Top Layer w0.305: v1(91.95,43.18) 97.03,43.18 99.57,40.64 v1(116.97,40.64)
  Bottom Layer w0.254: P7.7 P3.26 157.73,108.97 157.99,108.71 157.99,81.66 176.78,62.86 176.78,60.45 175.77,59.44 158.88,59.44 157.86,58.42 P6.7 157.86,53.59 157.73,53.47 157.73,51.05 156.97,50.29 v1(119.38,50.29) ; v1(59.94,83.69) 67.06,90.8 68.07,90.8 68.58,91.31 68.58,93.34 69.6,94.36 v1(70.61,94.36) ; v1(93.34,29.97) 92.33,30.99 92.33,34.04 H19.1 v1(91.95,43.18) v1(78.46,43.18) 74.3,43.18 v1(70.1,38.98) 72.51,36.58 v1(72.64,36.58) ; v1(72.64,91.05) R14.1 ; v1(88.39,92.33) 88.39,86.74 92.96,82.17 98.68,82.17 100.08,80.77 100.08,70.74 100.58,70.23 H10.1 102.11,68.07 110.74,59.44 v1(111.25,59.44)
  Bottom Layer w0.635: v1(111.25,59.44) 112.27,59.44 116.97,54.74 v1(116.97,40.64) 129.03,28.45 129.03,18.8 115.7,5.46 94.11,5.46 92.71,6.86 U11.15
5V1: length 178.9
  Top Layer w0.3: NOREF.4 93.72,105.8 R9.2 98.69,105.8 U4.3
  Top Layer w0.75: P2.29 150.24,53.59
  Top Layer w0.762: P6.4 150.24,57.91 151.76,59.44 175.26,59.44 176.78,60.96 176.78,64.39 161.04,80.14 U16.1 ; P7.4 P3.29
  Top Layer w1.27: P3.29 150.11,106.68 ; 150.11,106.68 122.94,106.68 119.38,110.24 116.46,110.24 116.12,110.58 ; 150.11,106.68 150.11,103.25 U16.1 U16.1 ; U4.3 101.6,107.19 103.12,106.17 107.19,106.17 ; 107.19,106.17 107.19,111.76 108.2,112.78 115.1,112.78 116.12,111.76 H12.1 ; 107.19,106.17 110.74,102.62 110.74,102.43 110.68,102.36
  Bottom Layer w0.65: U16.1 JP9.2
5V2: length 249.4
  Top Layer w0.3: 37.59,29.61 37.96,29.97 39.12,29.97 v1(39.62,30.48) ; v1(45.72,72.77) 50.42,72.77 51.5,73.85 C19.2 51.69,75.56 51.82,75.44 52.83,76.45 56.77,76.45 ; R16.2 89.92,95.62 R17.2 ; U1.8 32.51,71.63 31.5,71.63 v1(31.5,71.12) 30.48,70.1 28.96,70.1 28.7,69.85 C11.2 ; 56.77,76.45 59.94,76.45 63.25,73.15 v1(63.5,73.15) ; 56.77,76.45 56.77,76.2 ; 56.77,76.45 U17.3 ; R3.2 v1(69.6,92.84) ; R62.1 58.37,26.62 58.04,26.29 56.13,26.29 55.85,26.01 D14.2 ; R2.2 58.34,27.46 58.37,27.43 ; R104.1 34.8,23.62 v1(34.04,24.38) 33.53,23.88 33.53,19.3 34.54,18.29 41.15,18.29 v1(45.72,22.86)
  Top Layer w0.635: v1(53.59,22.86) v1(54.61,23.88) 54.61,24.64 55.25,25.27 D14.2
  Top Layer w1.27: 110.74,94.08 110.64,93.98 100.08,93.98
  Bottom Layer w0.3: v1(69.6,92.84) 70.29,92.14 70.56,91.9 ; v1(39.62,30.48) 39.62,29.97 v1(34.04,24.38) ; v1(45.72,72.77) 45.72,66.55 40.51,61.34 32.13,61.34 31.5,61.98 v1(31.5,71.12) ; 89.92,95.38 89.92,93.98 ; v1(45.72,22.86) v1(53.59,22.86)
  Bottom Layer w0.508: v1(54.61,23.88) v1(53.59,22.86)
  Bottom Layer w0.635: 100.08,93.98 72.64,93.98 64.21,85.55 64.21,28.65 62.99,27.43 58.42,27.43 57.15,26.16 v1(54.61,23.88) ; v1(63.5,73.15) 64.21,73.21
5V_WAS: length 182.3
  Top Layer w0.3: 109.35,71.5 v1(106.93,71.5) 106.3,72.14 106.3,73.59 ; 109.35,71.5 109.98,70.87 R63.1 R22.1 ; 109.35,71.5 U20.8 ; 55.88,102.62 55.88,103 96.27,103 97.92,101.35 97.92,83.95 99.57,82.3 v1(104.14,82.3) ; v1(110.49,88.65) 110.49,87.34 ; 54.14,104.65 55.88,104.65 ; 111.76,87.34 109.22,87.34
  Top Layer w1: 53.9,99.62 51.18,96.9 NOREF#4.3 50.42,96.52 43.57,96.52 ; v1(30.99,87.88) 30.99,90.42 37.08,96.52 48.26,96.52 ; U6.3 55.88,101.6 52.9,98.62
  Bottom Layer w0.3: v1(110.49,88.65) v1(104.14,82.3) 104.14,74.29 v1(106.93,71.5) 106.93,71.37 H9.1
  Bottom Layer w1: 16.8,77.22 16.8,79.16 25.53,87.88 v1(30.99,87.88)
+12V_BOARD: length 258.9
  Top Layer w0.254: Q9.3 30.48,49.53 31.75,48.26 45.08,48.26 47.54,45.8 R47.2 43.74,45.08 R19.1 ; D7.1 41.83,109.07 D12.1
  Top Layer w1.27: Q9.3 30.35,51.43 30.23,51.56 29.72,51.56 24.38,46.23 6.6,46.23 5.59,47.24 5.59,61.23 8.94,61.23 ; C15.1 81.15,111.63 C1.1 81.53,112.52 83.31,114.3 98.04,114.3 U4.1 ; 50.72,112.78 50.72,109.47 50.8,109.39 U6.1
  Top Layer w1.5: C15.1 67.06,112.14 65.53,113.66 46.42,113.66 D12.1 D6.2
  Bottom Layer w1.27: C15.1 66.93,111.51 64.77,111.51 58.42,105.16 58.42,54.74 55.5,51.82 44.2,51.82 41.66,54.36 31.5,54.36 30.48,53.34 Q9.3 ; U4.1 103.89,112.27 104.14,112.01 104.14,102.11 101.09,99.06 U5.1
+12V_IN: length 76.7
  Top Layer w0.254: D4.1 26.73,110.62 D12.2
  Top Layer w1.5: NOREF#2.1 17.44,98.28 D12.2 D6.1
  Bottom Layer w3.429: 8.8,53.22 5.7,53.23 5.33,53.59 5.33,90.17 13.44,98.28 NOREF#2.1
GND: length 952.6
  Top Layer w0.203: 53.09,83.31 46.23,83.31 45.72,82.8 v1(45.72,80.26) v1(44.7,80.26) ; 53.09,83.31 53.09,88.65 53.34,88.9 53.34,89.41 54.36,89.41 55.63,88.39 55.63,88.14 56.26,87.5 D5.3 ; 53.09,83.31 54.23,82.17 U17.8 ; v1(102.11,77.72) 98.55,77.72 98.55,73.41 U2.3 ; PWR/ETH.2 1.52,111.69 ; 1.52,111.69 1.52,98.3 1.65,98.17 3.24,98.17 AS-ACT.2 ; 1.52,111.69 1.52,116.33 17.27,116.33 16.76,115.82 16.76,106.68 18.29,105.16 22.35,106.55 LED18.2 ; GPS/RTK.2 1.52,104.83 ; v1(69.09,34.04) 69.09,33.02 67.06,33.02 v1(67.06,29.46) v1(62.99,29.46) 62.99,25.91 59.69,25.91 v1(59.69,25.01) U10.2 ; v2(29.46,57.91) 32.64,57.91 32.64,59.89 32.69,59.94 35.05,59.94 35.05,60.96 42.67,60.96 v2(42.67,57.91) ; C11.1 25.4,69.85 ; 25.4,69.85 25.4,71.69 C20.2 25.4,71.82 25.4,74.68 28.7,74.68 U1.5 ; 25.4,69.85 23.88,69.85 19.81,65.79 19.81,65.15 17.27,65.15 17.19,65.23 16.94,65.23 ; 16.89,65.22 15.43,65.22 15.24,65.02 15.24,63.5 14.73,62.99 14.73,62.23 13.97,61.47 14.1,61.34 14.1,61.21 11.18,61.21 11.18,60.71 10.92,60.45 10.92,59.82 10.67,59.56 10.67,57.15 ; 10.67,57.15 10.67,54.86 10.8,54.74 10.8,54.61 11.18,54.23 11.18,54.1 11.43,53.85 11.43,52.7 10.92,52.2 10.92,51.94 10.67,51.69 10.67,49.28 8.98,49.28 8.94,49.23 ; 10.67,57.15 9.4,57.15 9.32,57.23 8.94,57.23 ; Q3.3 49,51.43 47.24,51.43 47.12,51.31 46.23,51.31 v1(46.23,49.78) 45.21,49.78 45.21,51.82 44.7,52.32 v1(44.7,53.34) ; v1(59.94,72.64) 56.01,72.64 55.5,73.15 U17.2 ; U11.1 44.58,7.62 v1(44.2,8) 42.16,8 40.64,9.52 v1(40.64,11.43) ; v1(97.03,40.13) 88.14,40.13 88.14,43.12 C17.1 ; v1(42.67,22.86) 42.67,26.65 Q1.3 ; v1(42.67,80.26) v1(43.69,80.26) ; v1(93.98,92.33) 94.49,92.84 94.49,95.59 ; OPTO_STEER.3 62.99,35 v1(62.99,32) ; RJ1.14 9.65,12.91 9.65,10.54 C26.1 ; SW_STEER.4 SW_STEER.3 ; v2(34.04,58.29) 34,58.29 D8.1 ; v2(45.97,75.06) 50.1,75.06 C19.1 ; SW_WORK.4 SW_WORK.3 SW_REMOTE.4 SW_REMOTE.3 ; v1(82.8,31.88) 82.8,31.62 95.63,31.62 97.02,33 H19.3 ; H11.2 29.46,17.27 29.97,16.76 v1(45.21,16.76) ; v1(40.64,80.26) v1(41.66,80.26) ; R55.1 77.92,78.05 C3.1 ; U3.3 v1(72.14,64.13) ; U12.64 80.24,18.46 80.24,18.84 80.29,18.8 v1(80.77,18.8) ; 61.98,106.68 61.98,111.25 v1(54.18,111.25) 53.34,111.25 U6.2 ; U4.2 99.4,110.4 86.74,110.4 85.85,109.51 85.85,106.93 C1.2 77.85,106.93 77.72,107.06 77.22,106.55 C15.2
  Top Layer w0.508: 152.74,16.75 150.74,16.75
  Bottom Layer w0.203: 102.08,96.52 106.68,91.92 v1(106.68,88.9) ; 16.94,65.23 17.19,65.23 17.27,65.15 29.46,65.15 ; v1(42.67,22.86) 42.67,20.83 42.8,20.95 v1(52.58,20.95) ; P3.31 113.66,109.09 113.66,110.5 H12.2 ; P3.31 P3.30 ; P3.31 P7.2 ; v1(142.75,104.01) 147.57,104.01 P3.30 ; v2(45.97,75.06) 45.97,80.26 v1(45.72,80.26) ; v2(8.89,36.58) 8.94,36.62 8.94,49.23 ; P3.7 H7.7 v1(161.8,60.95) 161.8,60.45 147.7,60.45 P6.3 P6.2 ; v1(44.2,8) 9.65,8 9.65,12.91 RJ1.14 9.69,13.17 9.65,13.21 9.65,15.24 9.4,15.49 9.4,17.53 9.14,17.78 5.08,17.78 5.08,17.12 4.57,16.62 RJ1.11 1.74,24.79 4.57,24.79 5.08,24.28 5.08,23.37 9.65,23.37 9.65,28.41 RJ1.13 ; v1(106.68,88.9) 106.68,89.92 118.36,89.92 118.36,65.15 H9.2 ; v1(106.68,88.9) 100.08,88.9 100.08,82.3 102.11,80.26 v1(102.11,77.72) ; P3.30 P7.3 ; v1(40.64,11.43) 41.15,11.43 41.4,11.18 45.21,11.18 45.21,20.83 ; v1(52.58,20.95) v1(57.4,20.95) v1(52.58,20.95) ; 74.17,24.89 74.17,31.88 v1(82.8,31.88) ; 74.17,24.89 74.68,24.38 v1(91.53,24.38) 92.71,24.38 U10.15 92.71,20.32 80.77,20.32 v1(80.77,18.8) ; 74.17,24.89 v1(60.96,24.89) 59.69,24.89 U10.2 ; 74.17,24.89 74.17,25.91 ; v1(93.98,92.33) 95.63,92.33 96.01,91.95 102.11,91.95 v1(102.11,96.52) U5.2 ; H19.3 v1(97.03,40.13) ; v1(69.09,34.04) 69.09,35.56 68.07,36.58 v1(68.07,45.72) 68.07,64.13 v1(72.14,64.13) ; 118.36,69.6 144.53,69.6 144.53,60.31 147.7,60.31 ; v1(62.99,32) v1(62.99,29.46) ; U2.3 96.39,67.44 95.5,66.55 CN1.4 ; v1(44.7,53.34) 42.67,55.37 v2(42.67,57.91) ; 17.02,8 H3.1 H3.2 H3.3 H3.4 H3.5 H3.6 ; 29.46,65.15 29.46,73.41 J3.7 U2.5 ; 29.46,65.15 v2(29.46,57.91) ; v1(43.69,80.26) v1(44.7,80.26) ; v1(31.5,81.79) 31.5,78.23 32,77.72 34.04,77.72 34.54,76.2 J3.5 U2.5 40.13,76.2 40.13,78.23 40.64,78.92 v1(40.64,80.26) ; v1(16.76,87.38) 16.76,89.92 v1(18.8,93.98) 18.8,101.09 12.19,101.09 10.16,99.06 10.16,98.42 10.03,98.3 3.37,98.3 AS-ACT.2 ; v1(41.66,80.26) v1(42.67,80.26) ; RJ1.8 9.4,16.26
  vias: v1(24.38,108.2) v1(24.89,73.66) v1(26.92,73.66) v1(29.46,104.65) v1(29.46,103.12) v1(29.46,101.6) v1(37.59,102.49) v1(38.1,95) v1(38.1,93.98) v1(39.12,102.49) v1(39.62,95) v1(39.62,93.98) v1(40.64,102.49) v1(40.64,78.1) v1(40.64,76.07) v1(40.89,66.55) v1(40.89,65.53) v1(41.15,95) v1(41.15,93.98) v1(41.66,77.09) v1(41.66,73.53) v1(42.42,66.55) v1(42.42,65.53) v1(42.67,87.38) v1(42.67,85.85) v1(42.67,74.04) v1(42.67,73.02) v1(43.18,102.49) v1(43.18,21.72) v1(43.43,66.04) v1(43.69,95) v1(44.2,87.38) v1(44.2,85.85) v1(45.72,87.38) v1(45.72,85.85) v1(46.23,102.49) v1(46.74,95) v1(49.78,95) v1(50.29,20.7) v1(51.31,13.08) v1(52.32,106.68) v1(52.83,111.25) v1(52.83,95) v1(54.36,106.68) v1(59.69,13.26) v1(60.58,26.54) v1(62.48,17.65) v1(64.52,108.2) v1(64.52,105.16) v1(69.6,108.2) v1(69.6,105.16) v1(79.25,108.2) v1(79.25,105.66) v1(81.79,58.29) v1(83.82,108.2) v1(83.82,105.66) v1(84.33,50.67) v1(91.44,21.34) v1(91.46,58.8) v1(92.96,24.38) v1(93.98,21.34) v1(95,32.51) v1(96.01,36.58) v1(97.54,32.51) v1(98.04,111.25) v1(98.04,109.73) v1(98.04,108.2) v1(98.04,36.58) v1(102.11,97.54) v1(102.11,95.5) v1(108.2,48.64) v1(110.3,78.93) v1(111.25,76.71) v1(121.41,27.81) v1(122.22,19.96) v1(143.26,108.2) v1(143.76,113.28) v1(143.76,59.44) v1(143.76,51.82) v1(145.29,113.28) v1(145.29,59.44) v1(145.29,51.82) v1(146.3,108.2) v1(146.81,113.28) v1(146.81,59.44) v1(146.81,51.82) v1(148.34,113.28) v1(148.34,59.44) v1(148.34,51.82) v1(149.73,18.29) v1(150.75,18.29) v1(151.76,18.29) v1(152.78,18.29) v1(152.91,104.01) v1(153.67,13.08) v1(154.31,20.57) v1(154.69,13.08) v1(155.32,20.57) v1(155.7,13.08) v1(156.34,20.57) v1(157.48,18.29) v1(157.73,12.45) v1(158.5,65.53) v1(158.5,18.29) v1(158.75,12.45) v1(159.51,65.53) v1(159.51,18.29) v1(159.77,12.45) v1(160.53,60.96) v1(160.53,18.29) v1(163.07,60.96) v1(163.3,103.12) v1(163.3,100.54) v1(164.08,65.53) v1(165.1,65.53) v1(177.03,103.12) v1(177.03,100.54) v1(182.88,104.01) v2(14.22,36.58) v2(19.3,36.58) v2(28.96,41.15) v2(32.51,57.28) v2(33.02,41.15) v2(37.08,41.15)
A0: length 8.7
  Top Layer w0.203: JP1.2 82.8,27.69 82.8,25.91 83.31,25.4 85.85,25.4 87.63,23.62 U10.13
A7-RX5: length 68.8
  Top Layer w0.203: U10.6 69.85,24.51 71.75,26.42 71.75,37.46 73.66,39.37 83.19,39.37 84.46,38.1 99.95,38.1 100.58,37.46 109.85,37.46 111.51,35.81 111.51,32.77 109.85,31.11 105.66,31.11 SJ1.1
A10: length 153.3
  Top Layer w0.2: D19.1 D13.2
  Top Layer w0.203: D19.1 74.34,78.79 74.34,76 R6.1 C3.2 76.52,78.05 R55.2 76.71,78.35 76.71,79.25 77.22,79.76 v1(82.3,79.76)
  Bottom Layer w0.203: v1(82.3,79.76) 82.3,69.09 81.28,68.07 81.28,62.48 82.3,61.47 95,61.47 99.95,56.51 112.14,56.51 114.94,53.72 114.94,39.88 127.25,27.56 127.25,19.81 123.32,15.88 96.52,15.88 95.25,14.6 U11.16
A12: length 3.9
  Top Layer w0.203: U11.18 99.57,8.38 99.57,11.05 H2.1
A12B: length 144.2
  Top Layer w0.203: v1(42.67,13.72) 42.67,12.95 44.45,11.18 81.91,11.18 84.46,13.72 H2.2
  Bottom Layer w0.203: v1(42.67,13.72) 42.67,12.7 36.07,12.7 35.56,13.21 35.56,23.88 42.16,30.48 42.16,34.8 39.37,37.59 29.46,37.59 19.81,47.24 19.81,61.85 18.29,63.37 15.11,63.37 15.11,63.63 14.73,64.01 14.73,64.52 14.22,65.02 14.22,65.94 12.94,67.23
A13: length 3.9
  Top Layer w0.203: H5.1 102.87,10.41 U11.19
A13B: length 147.3
  Top Layer w0.203: v1(43.69,13.72) 43.69,12.7 44.7,11.68 80.77,11.68 84.84,15.75 102.62,15.75 103.63,14.73 H5.2
  Bottom Layer w0.203: v1(43.69,13.72) 43.69,12.7 43.18,12.19 35.56,12.19 35.05,12.7 35.05,24.13 41.66,30.73 41.66,34.54 39.12,37.08 29.21,37.08 19.3,46.99 19.3,58.42 18.54,59.18 15.49,59.18 14.73,59.94 14.73,60.45 14.22,60.96 14.22,61.94 12.94,63.23
A14: length 14
  Bottom Layer w0.203: H15.1 92.84,26.03 93.98,24.89 101.98,24.89 102.87,24 U10.19
A14B: length 99.2
  Top Layer w0.203: v1(40.64,31.5) 43.18,31.5 43.69,30.99 63.5,30.99 64.01,31.5 v1(66.04,31.5)
  Bottom Layer w0.203: H15.2 88.39,26.16 88.39,28.19 84.07,32.51 67.31,32.51 66.29,31.5 v1(66.04,31.5) ; v1(40.64,31.5) 40.64,34.8 38.86,36.58 28.96,36.58 18.8,46.74 18.8,54.36 18.03,55.12 15.24,55.12 14.99,55.37 14.99,55.75 14.73,56.01 14.73,56.39 14.22,56.9 14.22,57.91 14.19,57.94 14.19,57.97 12.94,59.23
A17: length 171.3
  Top Layer w0.203: v1(81.28,69.85) 80.01,71.12 54.99,71.12 53.97,72.14 33.91,72.14 33.91,73.79 32.89,74.8 31.24,74.8 U1.7
  Bottom Layer w0.203: v1(81.28,69.85) 80.65,69.21 80.65,52.07 85.72,46.99 111.25,46.99 112.4,45.85 112.4,38.73 124.97,26.16 124.97,21.08 122.17,18.29 97.16,18.29 95.25,20.19 U10.16
AS-ACT_1: length 11.5
  Top Layer w0.203: AS-ACT.1 4.38,95.82 9.65,101.09 9.65,102.62 10.16,103.12 R34.1
AS-ACT_3: length 10.2
  Top Layer w0.203: R35.1 8.64,105.16 8.13,104.65 8.13,103.57 5.08,100.52 AS-ACT.3
AS_ACT: length 214.9
  Top Layer w0.203: v1(14.22,103.63) 13.72,103.12 R34.2 ; U11.14 90.17,6.48 87.76,4.06 41.15,4.06 36.58,9.14 v1(36.58,13.72) ; v1(53.85,46.23) 53.47,46.61 53.47,52.7 52.83,53.34 v1(52.83,54.36)
  Bottom Layer w0.203: v1(36.58,13.72) 36.58,22.61 44.96,30.99 58.93,30.99 59.44,31.5 59.44,45.97 59.18,46.23 v1(53.85,46.23) ; v1(14.22,103.63) 17.27,103.63 20.32,100.58 24.51,100.58 26.42,98.68 26.42,92.71 28.7,90.42 54.36,90.42 54.86,89.92 54.86,58.67 53.85,57.66 53.85,55.37 v1(52.83,54.36)
AS_STB: length 211
  Top Layer w0.203: R35.2 v1(14.22,105.16) ; v1(53.85,54.36) 53.85,53.34 54.36,52.83 v1(54.36,47.24) ; U11.13 87.63,6.48 85.72,4.57 41.66,4.57 37.59,9.14 v1(37.59,13.72)
  Bottom Layer w0.203: v1(54.36,47.24) 54.86,46.74 59.44,46.74 59.94,46.23 59.94,31.24 59.18,30.48 45.21,30.48 37.59,22.86 v1(37.59,13.72) ; v1(14.22,105.16) 16.51,105.16 20.57,101.09 24.77,101.09 26.92,98.93 26.92,92.96 28.96,90.93 54.61,90.93 55.37,90.17 55.37,58.42 54.36,57.4 54.36,54.86 v1(53.85,54.36)
B/U_LED1_2: length 1.8
  Top Layer w0.2: R59.2 186.95,29.55
BNO-SDA: length 37.8
  Top Layer w0.203: H19.5 102.11,30.35 101.85,30.1 SJ1.2
  Top Layer w0.254: U10.9 77.47,30.23 78.36,31.11 95.88,31.11 96.6,30.4 R13.2 99.19,29.72 SJ1.3 SJ1.2
BY-ANT1: length 20.4
  Bottom Layer w0.2: H20.7 164.73,13.95 166.12,12.57 173.23,12.57 175.38,14.72 SJ_LED2.1
BY-ANT2: length 7.1
  Bottom Layer w0.2: 162.74,16.75 162.74,18.38 SJ_LED3.1
BYNAV/UM982: length 103.7
  Top Layer w0.203: 183.08,96.86 181.86,95.38 181.94,89.79
  Top Layer w1.2: U16.3 U16.3 184.16,89.79 C14.1 ; v3(166.73,19.68) v3(166.73,31.37)
  Bottom Layer w0.65: JP9.1 U16.3
  Bottom Layer w1.2: H20.6 v3(166.73,19.68) ; 166.74,31.47 166.74,42.66 184.16,60.08 C14.1
C20_1: length 4.9
  Top Layer w0.254: C20.1 27.18,71.63 29.97,71.63 U1.6
CANH1: length 69
  Top Layer w0.203: R64.2 60.33,80.98 60.33,78.74 59.94,78.36 55.88,78.36 55.5,78.74 U17.7 55.5,81.28 55.25,81.53 55.25,84.97 D5.2 54.86,85.48 54.86,87.38 v1(53.85,88.39)
  Bottom Layer w0.203: v1(53.85,88.39) 52.32,89.92 24.04,89.92 11.35,77.23 8.94,77.23
CANL1: length 72.6
  Top Layer w0.203: v1(52.32,88.39) 52.32,89.41 53.59,90.68 55.63,90.68 56.9,89.41 56.9,85.35 57.21,85.04 ; JP2.2 61.78,85.03 D5.1 57.28,84.97 57.28,81.79 56.77,81.28 U17.6
  Bottom Layer w0.203: 8.8,73.22 8.8,73.97 24.23,89.41 51.31,89.41 v1(52.32,88.39)
CANRX1: length 134.3
  Top Layer w0.203: v1(106.04,57.78) 100.33,57.78 99.06,59.05 99.06,69.21 97.16,71.12 93.98,71.12 92.71,72.39 62.1,72.39 60.96,73.66 58.42,73.66 58.04,74.04 U17.4
  Bottom Layer w0.203: v1(106.04,57.78) 111.76,57.78 115.57,53.97 115.57,40 127.76,27.81 127.76,19.56 120.9,12.7 115.44,12.7 110.49,7.75 U11.22
CANTX1: length 139.6
  Top Layer w0.203: v1(108.59,58.42) 107.19,57.02 99.82,57.02 98.43,58.42 98.43,68.58 96.52,70.48 93.34,70.48 92.07,71.75 55.63,71.75 54.23,73.15 U17.1
  Bottom Layer w0.203: U11.23 113.03,9.4 115.7,12.06 121.16,12.06 128.27,19.18 128.27,28.07 116.21,40.13 116.21,54.23 112.01,58.42 v1(108.59,58.42)
CYTRON_AUX: length 56.1
  Top Layer w3.429: 15.48,90.85 21.84,90.93 28.31,84.46 28.31,79.04 ; 8.8,69.22 5.33,69.23 5.33,84.71 11.43,90.8 15.48,90.85 ; 15.75,90.85 NOREF#6.2
D1_2: length 19.2
  Top Layer w0.203: D1.2 40.48,35.61 SW_STEER.2 SW_STEER.1 53.39,35.31 56.18,35.31
D4_2: length 1.8
  Top Layer w0.203: R106.2 D4.2
D9_2: length 19.8
  Top Layer w0.203: D9.2 71.93,86.61 ; SW_REMOTE.2 SW_REMOTE.1 74.42,92.58 75.18,91.82 75.18,87.76 74.04,86.61 OPTO_REMOTE.2
D11_2: length 40.6
  Top Layer w0.203: OPTO_WORK.2 86.23,87.88 84.84,89.28 84.84,91.82 85.6,92.58 SW_WORK.2 SW_WORK.1 86.69,100.13 85.34,101.47 71.63,101.47 69.6,99.44 D11.2
D15_1: length 11.3
  Top Layer w0.203: D15.1 D3.2 ; OPTO_SPEEDPULSE.3 32.59,26.8 v1(31.5,26.8)
  Bottom Layer w0.203: D15.1 29.24,26.8 v1(31.5,26.8)
DIR: length 137.9
  Top Layer w0.254: v1(83.82,55.88) 83.82,57.67 R5.1
  Bottom Layer w0.254: U11.6 69.85,9.14 71.77,11.07 83.2,11.07 85.72,13.59 85.72,15.88 86.36,16.51 123.19,16.51 126.75,20.07 126.75,27.18 114.3,39.62 114.3,53.47 111.89,55.88 98.93,55.88 98.3,56.51 97.16,56.51 95.88,55.24 92.46,55.24 91.19,56.51 84.71,56.51 84.07,55.88 v1(83.82,55.88)
ERR_STAT: length 13.1
  Bottom Layer w0.2: H20.26 146.73,17.58 151.38,22.22 SJ_LED3.3
ETHERNET: length 193.2
  Top Layer w0.203: v1(41.66,13.72) 41.66,13.21 44.2,10.67 73.66,10.67 74.93,9.4 U11.8 ; v1(56.9,49.78) v1(56.9,55.37) ; R36.2 13.07,110.74 v1(14.73,110.74)
  Bottom Layer w0.203: v1(56.9,49.78) 57.91,49.78 58.93,48.77 60.45,48.77 61.98,47.24 61.98,30.23 60.2,28.45 46.23,28.45 41.44,23.66 41.44,14.02 v1(41.66,13.72) ; v1(14.73,110.74) 15.75,109.73 15.75,108.2 21.34,102.62 25.53,102.62 28.45,99.69 28.45,93.73 29.72,92.46 55.37,92.46 56.9,90.93 56.9,57.66 55.88,56.64 55.88,55.88 56.39,55.37 v1(56.9,55.37)
FREEWHEELMOD: length 7.4
  Top Layer w0.254: CN1.3 88.77,66.28 R25.1
GPS/RTK_1: length 10.8
  Top Layer w0.203: R32.1 8.13,107.19 7.37,106.43 7.37,104.39 5.91,102.93 3.81,102.93 GPS/RTK.1
GPS/RTK_3: length 8.5
  Top Layer w0.203: R33.1 10.87,109.16 8.13,109.16 6.1,107.12 GPS/RTK.3
GPSFIX: length 204.3
  Top Layer w0.203: v1(39.62,13.72) 39.62,9.14 42.67,5.59 81.66,5.59 82.55,6.48 U11.11 ; v1(56.39,48.26) 56.39,48.77 55.88,49.28 v1(55.88,54.36) ; R33.2 12.95,108.71 v1(14.22,108.71)
  Bottom Layer w0.203: v1(55.88,54.36) 55.88,54.86 55.37,55.37 55.37,56.9 56.39,57.91 56.39,90.68 55.12,91.95 29.46,91.95 27.94,93.47 27.94,99.44 25.27,102.11 21.08,102.11 14.48,108.71 v1(14.22,108.71) ; v1(56.39,48.26) 56.9,47.75 59.94,47.75 60.96,46.74 60.96,30.73 59.69,29.46 45.72,29.46 39.62,23.37 v1(39.62,13.72)
H6_1: length 76.1
  Top Layer w0.254: P3.13 P8.3 130.18,62.74 130.18,60.32 130.81,59.69 137.16,59.69 139.7,57.15 139.7,53.34 135.25,48.89 135.25,14.6 138.18,11.68 144.91,11.68 P2.1 H6.1
H8_1: length 26.2
  Top Layer w0.254: CN1.1 84.46,66.5 84.46,65.28 83.69,64.52 R5.2
  Bottom Layer w0.254: CN1.1 84.5,69.6 93.14,78.23 96.01,78.23 96.27,78.49 U2.1
H8_2: length 23.2
  Top Layer w0.254: CN1.2 86.23,66.28 R23.2
  Bottom Layer w0.254: U2.2 96.27,75.95 96.01,75.69 92.09,75.69 86.5,70.1 CN1.2
H10_2: length 84.5
  Top Layer w0.254: v1(115.82,57.91) 115.82,45.21 119.13,41.91 119.13,35.56 110.24,26.67 93.22,26.67 90.68,29.21 86.36,29.21 JP1.1
  Bottom Layer w0.254: H10.2 103.76,72.77 104.62,71.91 104.62,69.12 v1(115.82,57.91)
H18_5: length 15.8
  Top Layer w0.254: JP4.2 93.09,48.64 93.98,49.53 93.98,51.56 94.49,52.07 H18.5
H24_LEDS_1: length 10.8
  Top Layer w0.2: 179.32,45.16 179.76,45.59 185.42,45.59 186.94,43.99 ; H24_LEDS.1 184.91,45.59 184.4,45.59
H24_LEDS_2: length 20.1
  Top Layer w0.2: H24_LEDS.2 181.1,49.91 176.78,45.59 R8.1 176.78,44.58 177.29,44.07 181.36,44.07 182.37,45.08 183.82,45.08 184.91,43.99
H24_LEDS_3: length 24.5
  Top Layer w0.2: 182.88,43.99 182.3,43.99 181.36,43.05 174.75,43.05 174.24,43.56 R29.1 181.54,52.45 H24_LEDS.3
L2: length 34.4
  Top Layer w0.2: v1(176.28,24.76) 182.81,24.76 R26.1 ; R38.1 184.91,42.98 176.78,34.85
  Bottom Layer w0.2: R8.2 176.78,33.4 177.29,32.89 177.29,25.78 v1(176.28,24.76) SJ_LED2.2
L3: length 48.9
  Top Layer w0.2: R28.1 174.61,34.85 174.24,34.85 ; R27.1 182.3,26.29 v1(176.28,26.29)
  Bottom Layer w0.2: SJ_LED3.2 157.99,23.24 161.04,26.29 v1(176.28,26.29) 176.28,30.86 174.24,32.89 R29.2
LED12_1: length 14.5
  Top Layer w0.203: OPTO_SPEEDPULSE.2 32.89,30.99 37.76,26.12 Q1.2 38.39,24.51 LED12.1
LED12_2: length 2.2
  Top Layer w0.254: R104.2 34.8,21.59 35.05,21.33 LED12.2
LED18_1: length 2.5
  Top Layer w0.254: LED18.1 20.24,110.46 R106.1
LED_REMOTE_1: length 3
  Top Layer w0.203: LED_REMOTE.1 72.38,90.3 R1.2
LED_STEER_1: length 2
  Top Layer w0.203: R15.2 LED_STEER.1
LED_WORK_1: length 3
  Top Layer w0.203: LED_WORK.1 86.44,89.54 R14.2
LEFT: length 33.1
  Top Layer w1.5: H22.2 38.35,69.85 38.1,70.1
  Top Layer w3.6: 33.02,68.58 30.51,67.31 28.63,67.31 22.53,61.22 16.8,61.22
LOCK: length 56.3
  Top Layer w0.4: U3.6 51.94,64.13 42.55,54.74 32.64,54.74 32.64,55.17
  Top Layer w1.5: 16.8,53.22 26.69,53.23 28.83,55.37 32.39,55.37 32.59,55.17 32.64,55.17 33.02,54.79 Q9.2
POWERON: length 192.3
  Top Layer w0.203: v1(40.64,13.72) 40.64,13.46 43.94,10.16 71.63,10.16 72.39,9.4 U11.7 ; v1(14.73,112.78) 13.07,112.78 R37.2 ; v1(57.91,48.77) 57.91,55.37 v1(56.9,56.39)
  Bottom Layer w0.203: v1(14.73,112.78) 16.26,111.25 16.26,108.46 21.59,103.12 25.91,103.12 28.96,100.08 28.96,93.98 29.97,92.96 55.63,92.96 57.4,91.19 57.4,57.4 56.9,56.9 v1(56.9,56.39) ; v1(40.64,13.72) 40.64,23.62 45.97,28.96 59.94,28.96 61.47,30.48 61.47,46.99 60.2,48.26 58.42,48.26 v1(57.91,48.77)
PRES/REM: length 59
  Top Layer w0.254: v1(49.28,87.88) 49.28,88.39 53.09,92.2 58.67,92.2 59.94,93.47 61.34,93.47 61.47,93.6
  Bottom Layer w0.254: 12.94,71.23 12.7,71.47 12.7,72.14 15.75,75.18 17.78,75.18 25.4,82.8 44.2,82.8 v1(49.28,87.88)
PRESSURESENSE: length 32.6
  Top Layer w0.254: 61.47,96.14 61.59,96.14 61.72,96.01 63.5,96.01 64.01,95.5 64.01,92.84 64.52,92.33 H4.1 67.06,92.2 66.71,92.2 66.71,84.36 65.53,83.18 65.53,76.83 66.42,75.95 72.78,75.95
